# Altium project REGENIX (1).PrjPCB (part 1 of 2)
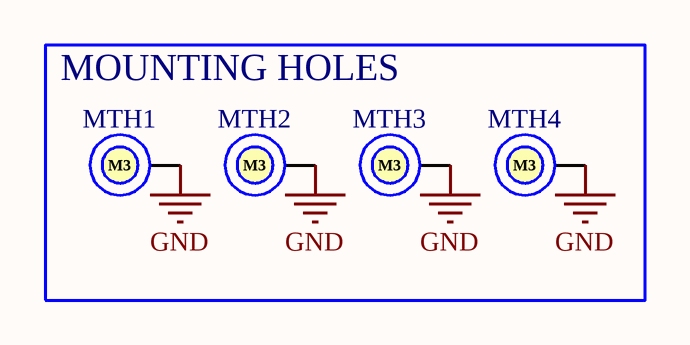
[diagram p0: REGENIX_TITLE.SchDoc]
Project_Date: 2025-02-27; Project_DateCode: DCXXXX; Project_Designer1: Edouard Moffet; Project_Designer2: Marylin Bechara; Project_Designer3: Mathieu Trudelle; Project_Designer4: -; Project_Global: Regenix Biotechnology; Project_Group: Main_PCB; Project_Name: PMC; Project_Revision: 0.00; Project_Stencil_Bot_Thickness: 0.1 MM; Project_Stencil_Top_Thickness: 0.1 MM
15 sheets, 396 parts. Net scope: flat (ports and power ports of the same name join across sheets).
Sheets:
  REGENIX_TITLE.SchDoc
  REGENIX_Battery_Protection.SchDoc
  REGENIX_RS485.SchDoc
  REGENIX_I2C.SchDoc
  REGENIX_Relais_12V.SchDoc
  REGENIX_USB-C.SchDoc
  REGENIX_ESP32.SchDoc
  REGENIX_DRIVER.SchDoc
  REGENIX_Convertisseurs.SchDoc
  REGENIX_DRIVER_2.SchDoc
  REGENIX_DRIVER_3.SchDoc
  REGENIX_Relais_24V_1.SchDoc
  REGENIX_Relais_24V_2.SchDoc
  REGENIX_Relais_24V_3.SchDoc
  REGENIX_Relais_24V_4.SchDoc

## Sheet REGENIX_TITLE.SchDoc
size Tabloid; Date: Date; Author: Author 1; DocumentNumber: 1; Revision: 1; SheetNumber: 1; SheetTotal: 12; Size: 11x17; Sheet_Name: Sheet Description

### Parts
MTH1  M3  [MTH_M3]  (no BOM)
MTH2  M3  [MTH_M3]  (no BOM)
MTH3  M3  [MTH_M3]  (no BOM)
MTH4  M3  [MTH_M3]  (no BOM)

### Blocks framed on the sheet
MOUNTING HOLES: MTH1-MTH4

### Nets
GND: MTH1.1 MTH2.1 MTH3.1 MTH4.1

### Notes on the sheet
- Revision history
- Package size conversion
- Metric
- 1005
- 1608
- Imperial
- 0402
- 0603
- Revision
- 2012
- 3216
- 0805
- 1206
- 3225
- 6432
- 1210
- 2512
- Date :
- Project Title
- Global Project
- Size
- Date
- Group
- Sheet
- of
- Filename
- Designers

### Library data of the parts
MTH1-MTH4 = MTH_M3: MTH - MOUNTING HOLE M3 PLATED - M3; GRAMS Lib Spec: 2.8; Magnetic Material: NO; Cryo: UNKNOWN; Value: *; Tolerance: *; Voltage Rating: *; Current Rating: *; Power Max: *; HelpURL: https://littlemachineshop.com/images/gallery/PDF/TapDrillSizes.pdf; CreatedBy/Date: Jonathan Bouchard 2018-07-23; VerifiedBy: Arnaud Samson 23-07-18; Temperature: *; Package: M3; Manufacturer #1: *; Manufacturer #2: *; Note: *; Assembly Type: NONE; Part Number #2: *; Part Number #1: *; Polarized: *; Supplier 1: *; Supplier Part Number 1: *

## Sheet REGENIX_Battery_Protection.SchDoc
size Tabloid; Date: Date; Author: Author 1; DocumentNumber: 2; Revision: 1; SheetNumber: 2; SheetTotal: 11; Size: 11x17; Sheet_Name: BATTERY PROTECTION & AUXILIARY
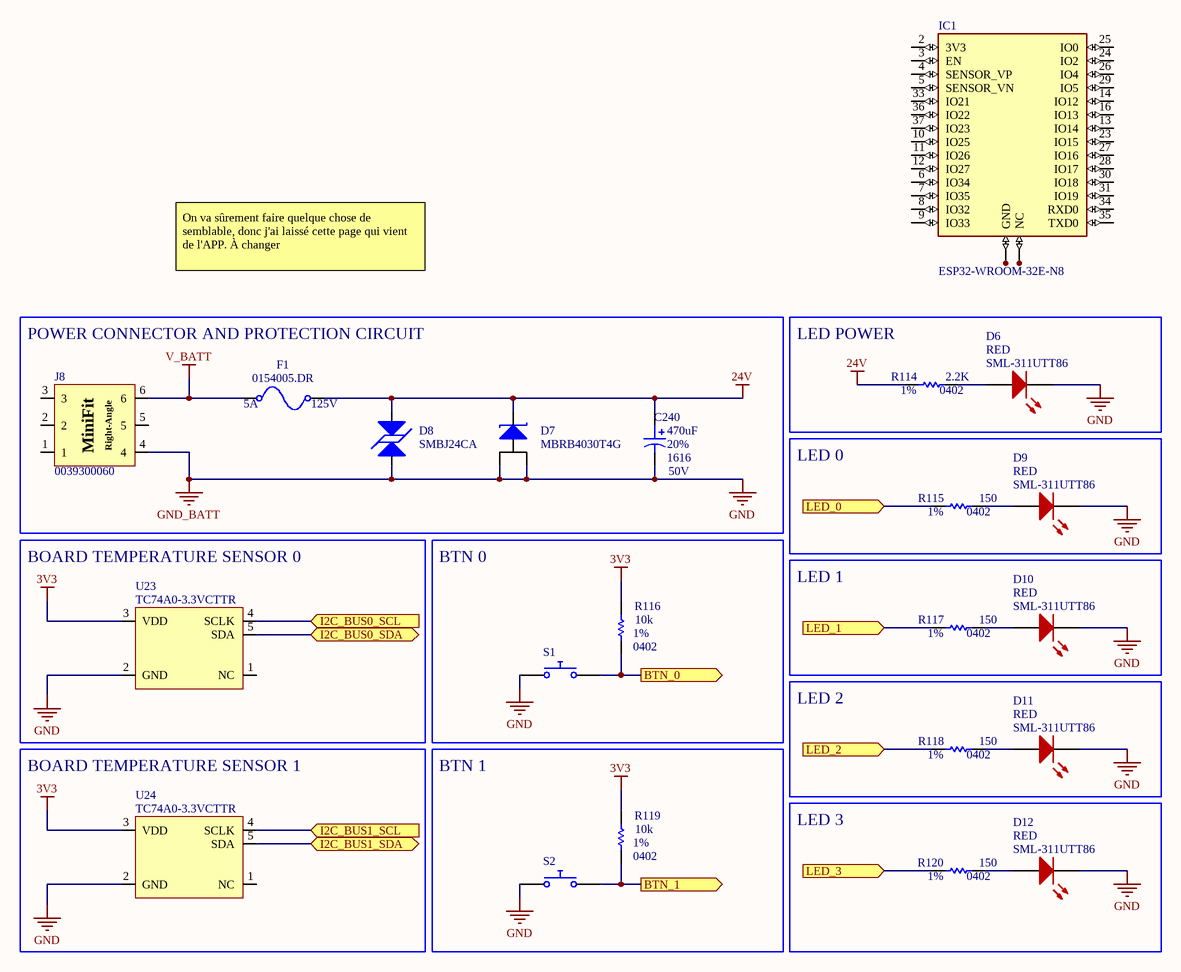
[diagram p1: REGENIX_Battery_Protection.SchDoc]

### Parts
C240  value 470uF  Voltage: 50V  Package: 1616  Precision: 20%  [CAP_ALU_1616_vishay]  (hidden comment: MAL214699108E3)
D6  SML-311UTT86  value RED  [LED_0603]
D7  MBRB4030T4G  [DIO_SCHOTTKY_MBRB4030T4G]
D8  SMBJ24CA  [TVS_PWR_SMBJ36CA]
D9  SML-311UTT86  value RED  [LED_0603]
D10  SML-311UTT86  value RED  [LED_0603]
D11  SML-311UTT86  value RED  [LED_0603]
D12  SML-311UTT86  value RED  [LED_0603]
F1  0154005.DR  Voltage Rating: 125V  Current Rating: 5A  [FUS_0154XXX.DR]
IC1  ESP32-WROOM-32E-N8  [ESP32WROOM32EN8]
J8  0039300060  [CON_MINIFIT_0039300060]
R114  value 2.2K  Package: 0402  Precision: 1%  [RES_0402]  (hidden comment: RES - 0402)
R115  value 150  Package: 0402  Precision: 1%  [RES_0402]  (hidden comment: RES - 0402)
R116  value 10k  Package: 0402  Precision: 1%  [RES_0402]  (hidden comment: RES - 0402)
R117  value 150  Package: 0402  Precision: 1%  [RES_0402]  (hidden comment: RES - 0402)
R118  value 150  Package: 0402  Precision: 1%  [RES_0402]  (hidden comment: RES - 0402)
R119  value 10k  Package: 0402  Precision: 1%  [RES_0402]  (hidden comment: RES - 0402)
R120  value 150  Package: 0402  Precision: 1%  [RES_0402]  (hidden comment: RES - 0402)
S1  Push Button Normally Opened  (value not drawn)
S2  Push Button Normally Opened  (value not drawn)
U23  TC74A0-3.3VCTTR  [SEN_TEMP_TC74A0-3.3VCTTR]
U24  TC74A0-3.3VCTTR  [SEN_TEMP_TC74A0-3.3VCTTR]

### Blocks framed on the sheet
POWER CONNECTOR AND PROTECTION CIRCUIT: C240 D7 D8 F1 J8
LED POWER: D6 R114
LED 0: D9 R115
BOARD TEMPERATURE SENSOR 0: U23
BTN 0: R116 S1
LED 1: D10 R117
LED 2: D11 R118
BOARD TEMPERATURE SENSOR 1: U24
BTN 1: R119 S2
LED 3: D12 R120

### Ports
BTN_0 (out), BTN_1 (out), I2C_BUS0_SCL (in), I2C_BUS0_SDA (bidir), I2C_BUS1_SCL (in), I2C_BUS1_SDA (bidir), LED_0 (in), LED_1 (in), LED_2 (in), LED_3 (in)

### Nets
3V3: R116.2 R119.2 U23.3(VDD) U24.3(VDD)
24V: C240.1 D7.4 D8.1 F1.2 R114.2
GND: C240.2 D6.K D7.1(A) D7.3 D8.2 D9.K D10.K D11.K D12.K J8.4 S1.1 S2.1 U23.2(GND) U24.2(GND)  [also labelled GND_BATT]
V_BATT: F1.1 J8.6
BTN_0: R116.1 S1.2 ; port BTN_0
BTN_1: R119.1 S2.2 ; port BTN_1
I2C_BUS0_SCL: U23.4(SCLK) ; port I2C_BUS0_SCL
I2C_BUS0_SDA: U23.5(SDA) ; port I2C_BUS0_SDA
I2C_BUS1_SCL: U24.4(SCLK) ; port I2C_BUS1_SCL
I2C_BUS1_SDA: U24.5(SDA) ; port I2C_BUS1_SDA
LED_0: R115.2 ; port LED_0
LED_1: R117.2 ; port LED_1
LED_2: R118.2 ; port LED_2
LED_3: R120.2 ; port LED_3
NetD6_A: D6.A R114.1
NetD9_A: D9.A R115.1
NetD10_A: D10.A R117.1
NetD11_A: D11.A R118.1
NetD12_A: D12.A R120.1
NetIC1_1: IC1.1(GND) IC1.15(GND) IC1.38(GND) IC1.39(GND) IC1.40(GND) IC1.41(GND) IC1.42(GND) IC1.43(GND) IC1.44(GND) IC1.45(GND) IC1.46(GND) IC1.47(GND)
NetIC1_17: IC1.17(NC) IC1.18(NC) IC1.19(NC) IC1.20(NC) IC1.21(NC) IC1.22(NC) IC1.32(NC)

Not connected (* = marked no-connect by the designer): IC1 2(3V3) 3(EN) 4(SENSOR_VP) 5(SENSOR_VN) 6(IO34) 7(IO35) 8(IO32) 9(IO33) 10(IO25) 11(IO26) 12(IO27) 13(IO14) 14(IO12) 16(IO13) 23(IO15) 24(IO2) 25(IO0) 26(IO4) 27(IO16) 28(IO17) 29(IO5) 30(IO18) 31(IO19) 33(IO21) 34(RXD0) 35(TXD0) 36(IO22) 37(IO23); J8 1 2 3 5; U23 1(NC); U24 1(NC)

### Notes on the sheet
- On va sûrement faire quelque chose de semblable, donc j'ai laissé cette page qui vient de l'APP. À changer
- Sheet Name
- Project Title
- Global Project
- Revision
- Size
- Date
- Group
- Sheet
- of
- Filename
- Designers
- (in symbol CON_MINIFIT_0039300060) MiniFit; Right-Angle

### Library data of the parts
C240 = CAP_ALU_MAL214699108E3: CAP - ALU 470uF 20% 50V - 1616; Current: 1.3A; Mfg: Vishay Dale; Mfg Part Number: MAL214699108E3; HelpURL: http://www.vishay.com/docs/28403/146cti.pdf; CreatedBy: Jonathan Bouchard; Temperature: -55°C to 125°C; Power: *; Supplier 1: Digikey; Supplier Part Number 1: 4442PHCT-ND
D6 D9-D12 = LED_SML-311UTT86: LED - 620nM RED 2mA - 0603; Voltage: 1.8V; Mfg: ROHM Semiconductor; Power: 44mW; Current: 2mA; HelpURL: http://media.digikey.com/pdf/Data%20Sheets/Rohm%20PDFs/SML-311%20Series.pdf; CreatedBy: Jonathan Bouchard; Temperature: -30°C to 85°C; Package: 0603; Precision: *; Mfg Part Number: SML-311UTT86; Supplier 1: Digikey; Supplier Part Number 1: 511-1304-1-ND
D7 = DIO_SCHOTTKY_MBRB4030T4G: DIO - 30V MAX 40 A - TO-263-3; Manufacturer #1: ON Semiconductor; Value: Vf = 550mV @ 40A; Current Rating: 40A; GRAMS Lib Spec: 2.8; Magnetic Material: NO; Polarized: Yes; Cryo: UNKNOWN; Tolerance: *; Voltage Rating: 30V; Power Max: *; HelpURL: http://www.onsemi.com/pub/Collateral/MBRB4030-D.PDF; CreatedBy/Date: Arnaud Samson - 06/07/18; VerifiedBy: Jonathan Bouchard 2018-07-12; Temperature: -65°C ~ 175°C; Package: D2PAK; Manufacturer #2: *; Note: *; Assembly Type: SMD; Part Number #2: *; Part Number #1: MBRB4030T4G; Supplier 1: Digi-Key; Supplier Part Number 1: MBRB4030T4GOSCT-ND
D8 = TVS_PWR_SMBJ24CA: TVS - 24V 26.7V 600W - DO214AA; Manufacturer #1: Littelfuse Inc.; Value: Vbr = 26.7V -  Clamp = 38.9V; Voltage Rating: 24V Standoff; Current Rating: 15.5A; GRAMS Lib Spec: 2.8; Magnetic Material: UNKNOWN; Polarized: NO; Tolerance: *; Power Max: 600W; HelpURL: http://www.littelfuse.com/~/media/electronics/datasheets/tvs_diodes/littelfuse_tvs_diode_smbj_datasheet.pdf.pdf; CreatedBy/Date: Arnaud Samson - 06/07/18; VerifiedBy: Jonathan Bouchard - 2018-07-13; Temperature: -65°C ~ 150°C (TJ); Package: DO214AA; Manufacturer #2: *; Note: *; Assembly Type: SMD; Part Number #2: *; Part Number #1: SMBJ24CA; Supplier 1: Digi-Key; Supplier Part Number 1: SMBJ24CALFCT-ND; Cryo: UNKNOWN
F1 = FUS_0154005.DR: FUS - 5 A 125 VAC/VDC - 2-SMD; Manufacturer #1: Littelfuse Inc.; Value: 5A 125V AC/DC FAST; GRAMS Lib Spec: 2.8; Magnetic Material: UNKNOWN; Polarized: NO; Tolerance: *; Power Max: *; HelpURL: http://www.littelfuse.com/~/media/electronics/datasheets/fuses/littelfuse_fuse_154_154t_154l_154tl_datasheet.pdf.pdf; CreatedBy/Date: Arnaud Samson - 06/07/18; VerifiedBy: Jonathan Bouchard 2018-07-16; Temperature: -55°C ~ 125°C; Package: 2-SMD; Manufacturer #2: *; Note: *; Assembly Type: SMD; Part Number #2: *; Part Number #1: 0154005.DR; Supplier 1: Digi-Key; Supplier Part Number 1: F1228CT-ND; Cryo: UNKNOWN
IC1 = ESP32-WROOM-32E-N8: Bluetooth, WiFi 802.11b/g/n, Bluetooth v4.2 +EDR, Class 1, 2 and 3 Transceiver Module 2.4GHz ~ 2.5GHz PCB Trace Surface Mount; MF: Espressif Systems; SnapEDA_Link: https://www.snapeda.com/parts/ESP32-WROOM-32E-N8/Espressif+Systems/view-part/?ref=snap; Package: SMD-44 Espressif Systems; Value: *; MP: ESP32-WROOM-32E-N8; Check_prices: https://www.snapeda.com/parts/ESP32-WROOM-32E-N8/Espressif+Systems/view-part/?ref=eda
J8 = CON_MINIFIT_0039300060: CON - Mini-Fit Through Hole, Right Angle 6 position; Manufacturer #1: Molex; Current Rating: 8A; GRAMS Lib Spec: 2.8; Magnetic Material: Unknown; Polarized: Yes; Voltage Rating: 600V; Assembly Type: TH; CreatedBy/Date: Joel Lemay 2018-06-21; HelpURL: https://www.molex.com/pdm_docs/sd/039300060_sd.pdf; Manufacturer #2: *; Package: TH; Part Number #1: 0039300060; Part Number #2: *; Power Max: *; Supplier 1: Digi-Key; Supplier Part Number 1: WM21353-ND; Temperature: - 40°C to + 80°C; Tolerance: *; Value: *; VerifiedBy: Caroline Paulin - 10 sept 2018; Cryo: UNKNOWN
R114-R120 = RES - 0402: Voltage: 50V; Power: 1/16W; Current: *; CreatedBy: Jonathan Bouchard
S1 S2 = Push Button NO: closed: 0; Rclosed: 1m; Ropen: 1Meg; SimulationGenericComponent: True
U23 U24 = SENS_TEMP_TC74A0-3.3VCTTR: SENS - TEMPERATURE SENSOR I2C/SMBUS - SOT23-5; Voltage: 2.7 V ~ 5.5 V; Mfg: Microchip; Precision: ±2°C (±3°C); Current: *; Power: *; Mfg Part Number: TC74A0-3.3VCTTR; HelpURL: http://ww1.microchip.com/downloads/en/DeviceDoc/21462D.pdf; CreatedBy: Jonathan Bouchard; Temperature: -40°C ~ 125°C; Value: *; Package: SOT23-5; Supplier 1: Digikey; Supplier Part Number 1: TC74A0-3.3VCTDKR-ND

## Sheet REGENIX_RS485.SchDoc
size Tabloid; Date: Date; Author: Author 1; DocumentNumber: 3; Revision: 1; SheetNumber: 4; SheetTotal: 17; Size: 11x17; Sheet_Name: RS485
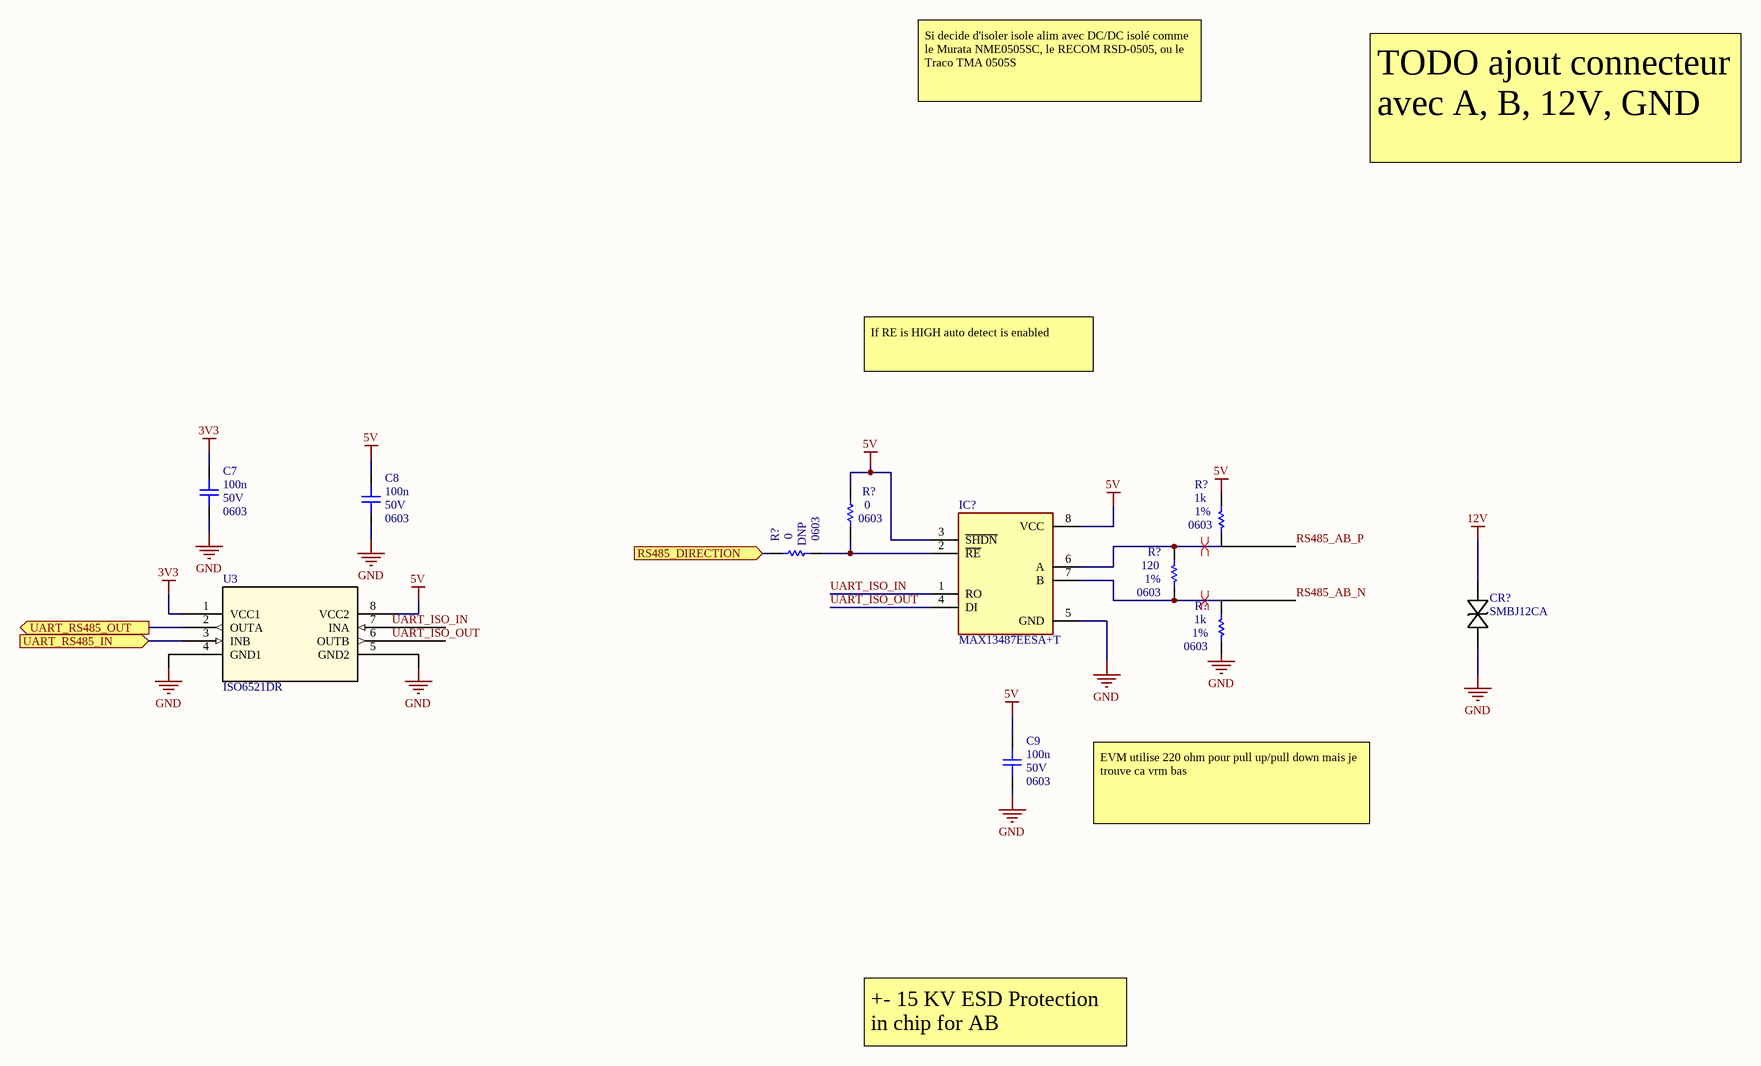
[diagram p2: REGENIX_RS485.SchDoc]

### Parts
(Parts that share a designator on the sheet are numbered #1, #2 ... from top to bottom, then left to right.)
C7  value 100n  Voltage: 50V  Package: 0603  [CAP_0603]  (hidden comment: CAP - 0603)
C8  value 100n  Voltage: 50V  Package: 0603  [CAP_0603]  (hidden comment: CAP - 0603)
C9  value 100n  Voltage: 50V  Package: 0603  [CAP_0603]  (hidden comment: CAP - 0603)
CR?  SMBJ12CA  [SMBJSeries_LTF]
IC?  MAX13487EESA+T  [SOIC127P600X175-8N]
R?#1  value 0  Package: 0603  [RES_0603]  (hidden comment: RES - 0603)
R?#2  value 1k  Package: 0603  Precision: 1%  [RES_0603]  (hidden comment: RES - 0603)
R?#3  value 0  NI: DNP  Package: 0603  [RES_0603]  (hidden comment: RES - 0603)
R?#4  value 120  Package: 0603  Precision: 1%  [RES_0603]  (hidden comment: RES - 0603)
R?#5  value 1k  Package: 0603  Precision: 1%  [RES_0603]  (hidden comment: RES - 0603)
U3  ISO6521DR  [SOIC8_D_TEX]

### Ports
RS485_DIRECTION (in), UART_RS485_IN (in), UART_RS485_OUT (out)

### Nets
3V3: C7.2 U3.1(VCC1)
5V: C8.2 C9.2 IC?.3(~{SHDN}) IC?.8(VCC) R?#1.2 R?#2.2 U3.8(VCC2)
12V: CR?.1
GND: C7.1 C8.1 C9.1 CR?.2 IC?.5(GND)
RS485_DIRECTION: R?#3.2 ; port RS485_DIRECTION
UART_ISO_IN: IC?.1(RO)
UART_ISO_OUT: IC?.4(DI)
UART_RS485_IN: U3.3(INB) ; port UART_RS485_IN
UART_RS485_OUT: U3.2(OUTA) ; port UART_RS485_OUT
NetIC?_2: IC?.2(~{RE}) R?#1.1 R?#3.1
NetIC?_6: IC?.6(A) R?#2.1 R?#4.2
NetIC?_7: IC?.7(B) R?#4.1 R?#5.2

Not connected (* = marked no-connect by the designer): R?#5 1; U3 4(GND1) 5(GND2) 6(OUTB) 7(INA)

### Layout directives
differential pair: NetIC?_6, NetIC?_7

### Notes on the sheet
- Si decide d'isoler isole alim avec DC/DC isolé comme le Murata NME0505SC, le RECOM RSD-0505, ou le Traco TMA 0505S
- TODO ajout connecteur avec A, B, 12V, GND
- If RE is HIGH auto detect is enabled
- EVM utilise 220 ohm pour pull up/pull down mais je trouve ca vrm bas
- +- 15 KV ESD Protection in chip for AB
- Labels drawn without touching a wire or pin: GND, RS485_AB_N, RS485_AB_P, UART_ISO_IN, UART_ISO_OUT
- Sheet Name
- Project Title
- Global Project
- Revision
- Size
- Date
- Group
- Sheet
- of
- Filename
- Designers

### Library data of the parts
C7-C9 = CAP - 0603: Precision: 10%; Current: *; CreatedBy: Jonathan Bouchard; Power: *
CR? = SMBJ12CA: No Description Available; Mfr_Name: Littelfuse Inc
IC? = MAX13487EESA+T: Integrated Circuit; Manufacturer_Name: Analog Devices; Datasheet Link: https://datasheets.maximintegrated.com/en/ds/MAX13487E-MAX13488E.pdf; Height: 1.75mm; Manufacturer_Part_Number: MAX13487EESA+T; Mouser Part Number: 700-MAX13487EESAT; Mouser Price/Stock: https://www.mouser.co.uk/ProductDetail/Analog-Devices-Maxim-Integrated/MAX13487EESA%2bT?qs=CDqwynd4ZNqR%252BznpqLLGdQ%3D%3D; Arrow Part Number: MAX13487EESA+T; Arrow Price/Stock: https://www.arrow.com/en/products/max13487eesat/analog-devices?utm_currency=USD&region=nac
R?#1 R?#3 = RES - 0603: Precision: 1%; Current: *; CreatedBy: Jonathan Bouchard
U3 = ISO6521DR: No Description Available; Mfr_Name: Texas Instruments; RefDes: RefDes; Type: Type
R?#2 R?#4 R?#5 = RES - 0603: Current: *; CreatedBy: Jonathan Bouchard

## Sheet REGENIX_I2C.SchDoc
size Tabloid; SheetNumber: 5; SheetTotal: 17; Sheet_Name: Insert name in Document Parameters; Size: 11x17
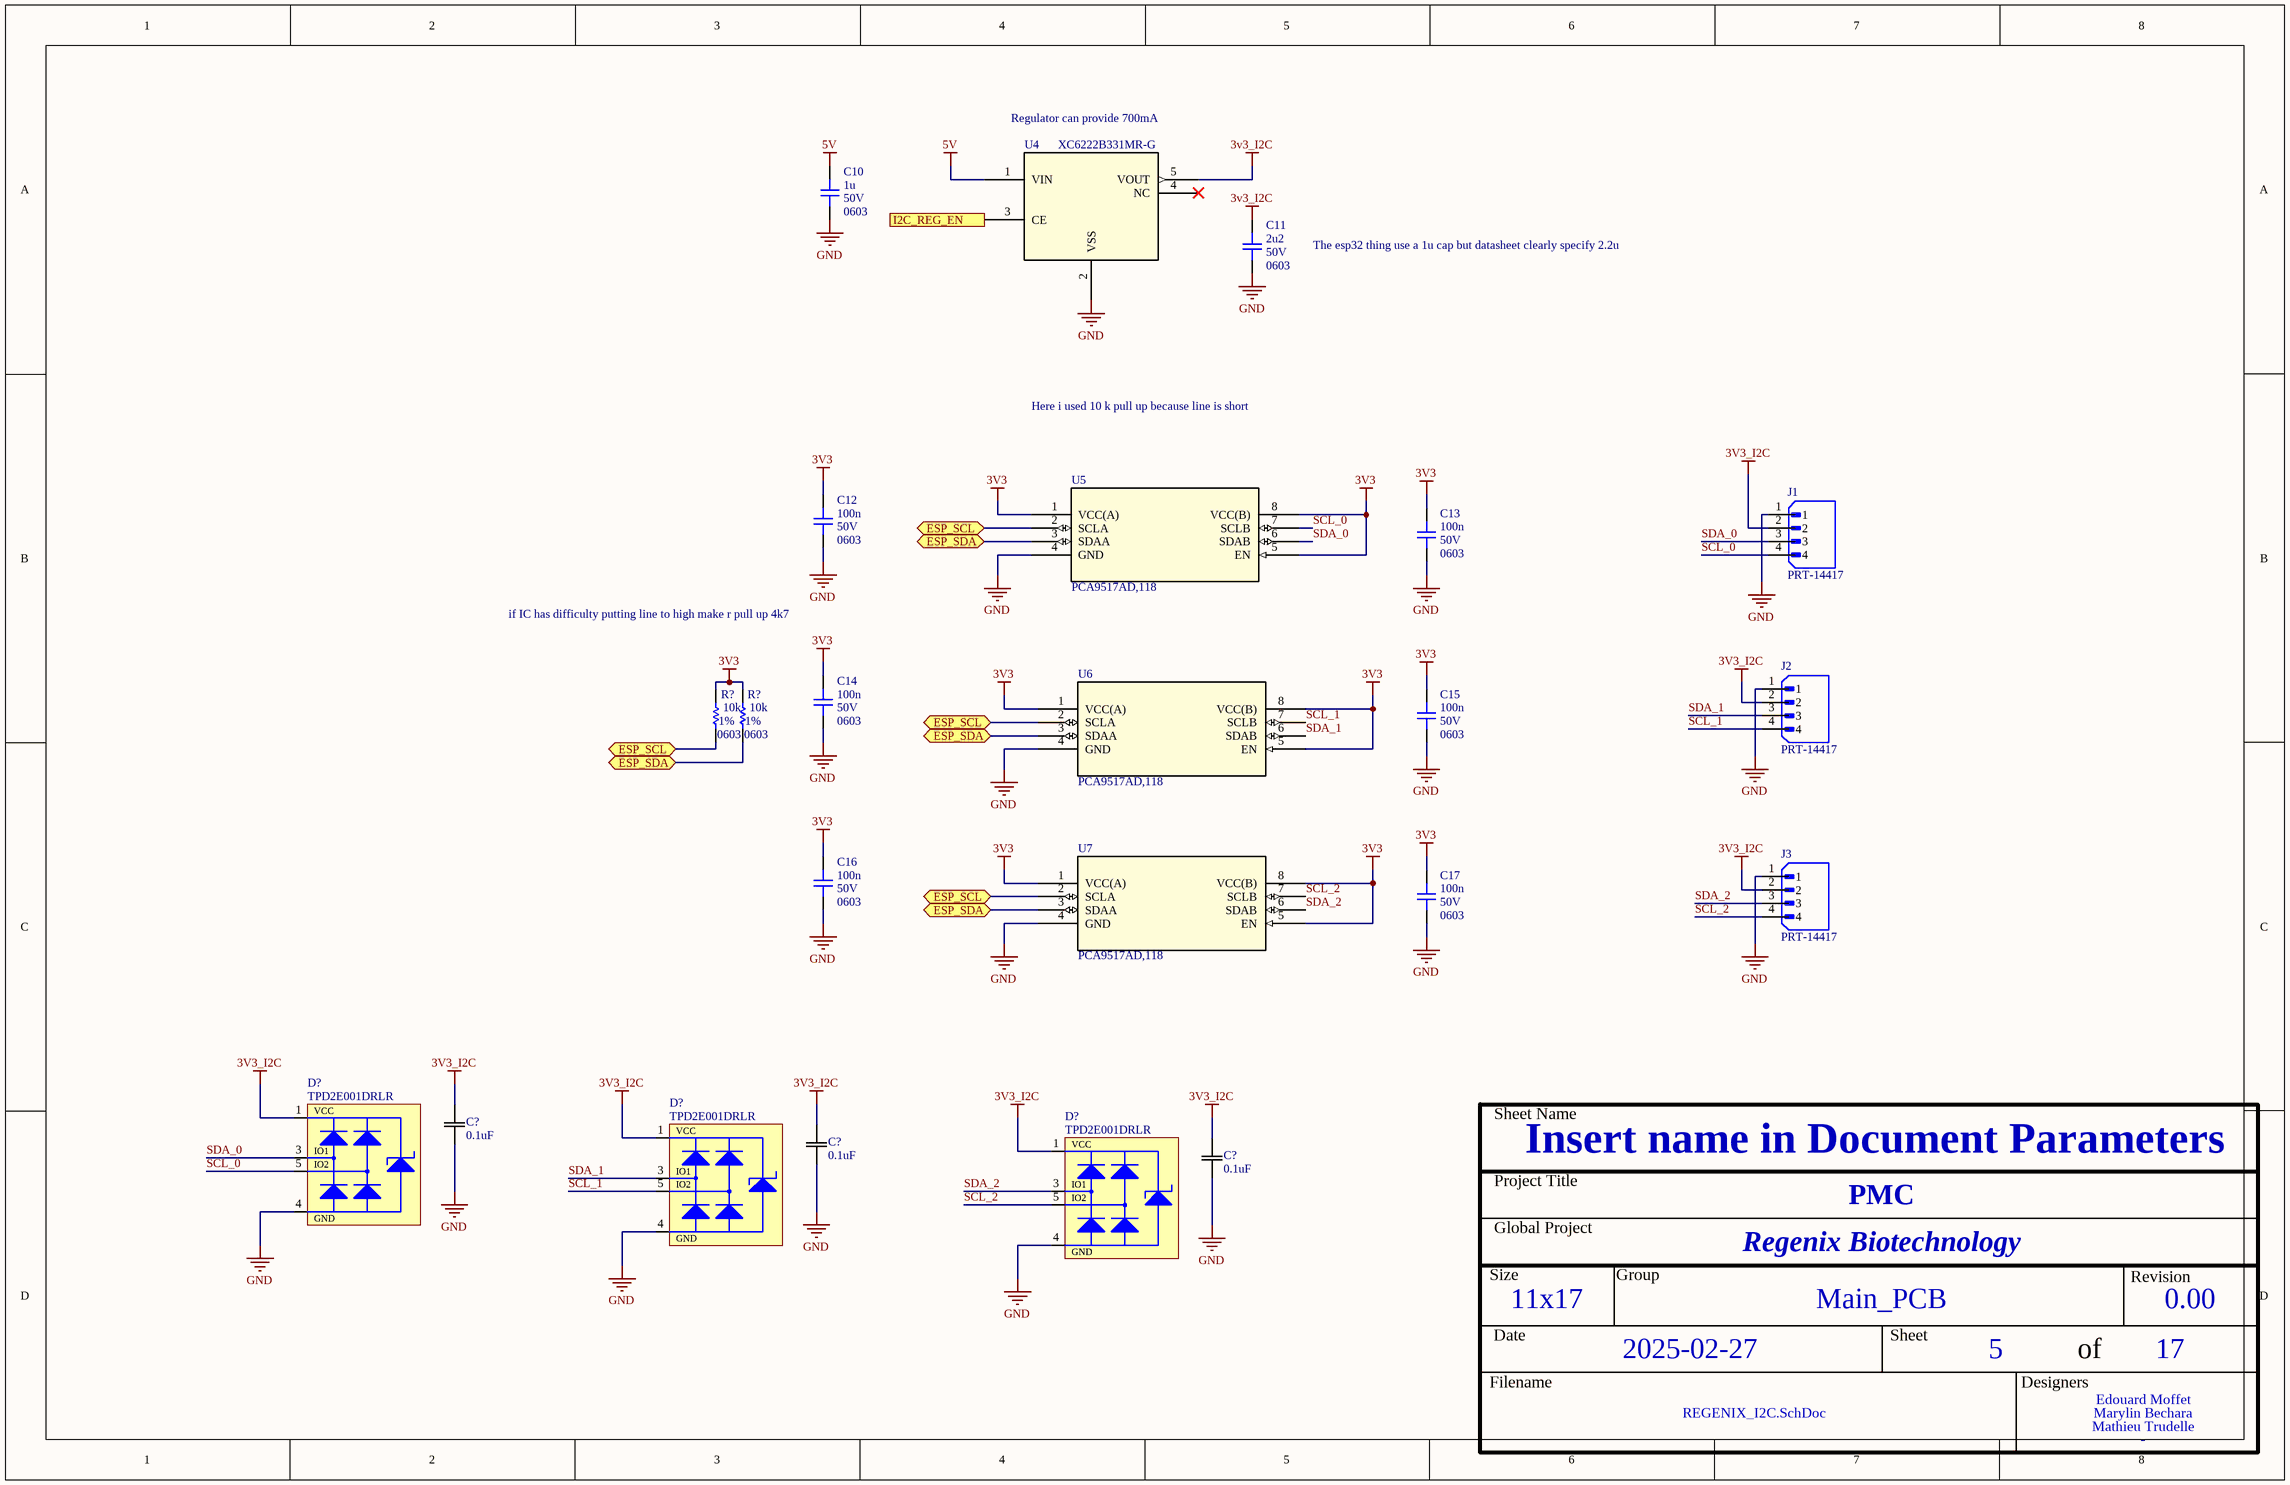
[diagram p3: REGENIX_I2C.SchDoc]

### Parts
(Parts that share a designator on the sheet are numbered #1, #2 ... from top to bottom, then left to right.)
C10  value 1u  Voltage: 50V  Package: 0603  [CAP_0603]  (hidden comment: CAP - 0603)
C11  value 2u2  Voltage: 50V  Package: 0603  [CAP_0603]  (hidden comment: CAP - 0603)
C12  value 100n  Voltage: 50V  Package: 0603  [CAP_0603]  (hidden comment: CAP - 0603)
C13  value 100n  Voltage: 50V  Package: 0603  [CAP_0603]  (hidden comment: CAP - 0603)
C14  value 100n  Voltage: 50V  Package: 0603  [CAP_0603]  (hidden comment: CAP - 0603)
C15  value 100n  Voltage: 50V  Package: 0603  [CAP_0603]  (hidden comment: CAP - 0603)
C16  value 100n  Voltage: 50V  Package: 0603  [CAP_0603]  (hidden comment: CAP - 0603)
C17  value 100n  Voltage: 50V  Package: 0603  [CAP_0603]  (hidden comment: CAP - 0603)
C?#1  0.1uF  [CAP_CL10_SAM]
C?#2  0.1uF  [CAP_CL10_SAM]
C?#3  0.1uF  [CAP_CL10_SAM]
D?#1  TPD2E001DRLR  [TVS_USB_TPD2E001DRLR]
D?#2  TPD2E001DRLR  [TVS_USB_TPD2E001DRLR]
D?#3  TPD2E001DRLR  [TVS_USB_TPD2E001DRLR]
J1  PRT-14417  [SPARKFUN_PRT-14417]
J2  PRT-14417  [SPARKFUN_PRT-14417]
J3  PRT-14417  [SPARKFUN_PRT-14417]
R?#6  value 10k  Package: 0603  Precision: 1%  [RES_0603]  (hidden comment: RES - 0603)
R?#7  value 10k  Package: 0603  Precision: 1%  [RES_0603]  (hidden comment: RES - 0603)
U4  XC6222B331MR-G  [SOT-25_TOR]
U5  PCA9517AD,118  [SO8_SOT96-1_NXP]
U6  PCA9517AD,118  [SO8_SOT96-1_NXP]
U7  PCA9517AD,118  [SO8_SOT96-1_NXP]

### Ports
ESP_SCL (bidir), ESP_SDA (bidir), I2C_REG_EN

### Nets
3V3: C12.2 C13.2 C14.2 C15.2 C16.2 C17.2 R?#6.2 R?#7.2 U5.1(VCC(A)) U5.5(EN) U5.8(VCC(B)) U6.1(VCC(A)) U6.5(EN) U6.8(VCC(B)) U7.1(VCC(A)) U7.5(EN) U7.8(VCC(B))
3V3_I2C: C11.2 C?#1.2 C?#2.2 C?#3.2 D?#1.1(VCC) D?#2.1(VCC) D?#3.1(VCC) J1.2 J2.2 J3.2 U4.5(VOUT)
5V: C10.2 U4.1(VIN)
GND: C10.1 C11.1 C12.1 C13.1 C14.1 C15.1 C16.1 C17.1 C?#1.1 C?#2.1 C?#3.1 D?#1.4(GND) D?#2.4(GND) D?#3.4(GND) J1.1 J2.1 J3.1 U4.2(VSS) U5.4(GND) U6.4(GND) U7.4(GND)
ESP_SCL: R?#6.1 U5.2(SCLA) U6.2(SCLA) U7.2(SCLA) ; port ESP_SCL
ESP_SDA: R?#7.1 U5.3(SDAA) U6.3(SDAA) U7.3(SDAA) ; port ESP_SDA
I2C_REG_EN: U4.3(CE) ; port I2C_REG_EN
SCL_0: D?#1.5(IO2) J1.4 U5.7(SCLB)
SCL_1: D?#2.5(IO2) J2.4 U6.7(SCLB)
SCL_2: D?#3.5(IO2) J3.4 U7.7(SCLB)
SDA_0: D?#1.3(IO1) J1.3 U5.6(SDAB)
SDA_1: D?#2.3(IO1) J2.3 U6.6(SDAB)
SDA_2: D?#3.3(IO1) J3.3 U7.6(SDAB)

Not connected (* = marked no-connect by the designer): D?#1 2(NC); D?#2 2(NC); D?#3 2(NC); U4 4(NC)*

### Notes on the sheet
- Regulator can provide 700mA
- The esp32 thing use a 1u cap but datasheet clearly specify 2.2u
- Here i used 10 k pull up because line is short
- if IC has difficulty putting line to high make r pull up 4k7
- Sheet Name
- Project Title
- Global Project
- Size
- Group
- Revision
- Date
- Sheet
- of
- Filename
- Designers

### Library data of the parts
C10-C17 = CAP - 0603: Precision: 10%; Current: *; CreatedBy: Jonathan Bouchard; Power: *
C?#1-C?#3 = CL10B104KB8NNWC: CAP CER 0.1UF 50V X7R 0603 CL10B104KB8NNWC; Mfr_Name: Samsung
D?#1-D?#3 = TVS_USB_TPD2E001DRLR: TVS - USB TVS DIODE 5.5V - SOT-553; Manufacturer #1: Texas Instruments; Value: 11V Breakdown; Voltage Rating: 5.5V (Max); GRAMS Lib Spec: 2.8; Magnetic Material: YES; Cryo: UNKNOWN; Tolerance: *; Current Rating: *; Power Max: *; HelpURL: http://www.ti.com/lit/ds/symlink/tpd2e001.pdf; CreatedBy/Date: Jonathan Bouchard 2018-07-10; VerifiedBy: Arnaud Samson 16-07-18; Temperature: -40°C ~ 85°C (TA); Package: SOT-553; Manufacturer #2: *; Note: *; Assembly Type: SMD; Part Number #2: *; Part Number #1: TPD2E001DRLR; Polarized: YES; Supplier 1: Digi-Key; Supplier Part Number 1: 296-21883-1-ND
J1-J3 = PRT-14417: QWIIC JST CONNECTOR - SMD 4-PIN; MF: SparkFun Electronics; SnapEDA_Link: https://www.snapeda.com/parts/PRT-14417/SparkFun+Electronics/view-part/?ref=snap; Package: None; Value: *; MP: PRT-14417; Check_prices: https://www.snapeda.com/parts/PRT-14417/SparkFun+Electronics/view-part/?ref=eda
U4 = XC6222B331MR-G: No Description Available; Mfr_Name: Torex Semiconductor; RefDes: RefDes; Type: Type
U5-U7 = PCA9517AD,118: No Description Available; Mfr_Name: NXP; RefDes: RefDes; Type: Type
R?#6 R?#7 = RES - 0603: Current: *; CreatedBy: Jonathan Bouchard

## Sheet REGENIX_Relais_12V.SchDoc
size Tabloid; Date: Date; Author: Author 1; DocumentNumber: 2; Revision: 1; SheetNumber: 6; SheetTotal: 17; Size: 11x17; Sheet_Name: BATTERY PROTECTION & AUXILIARY
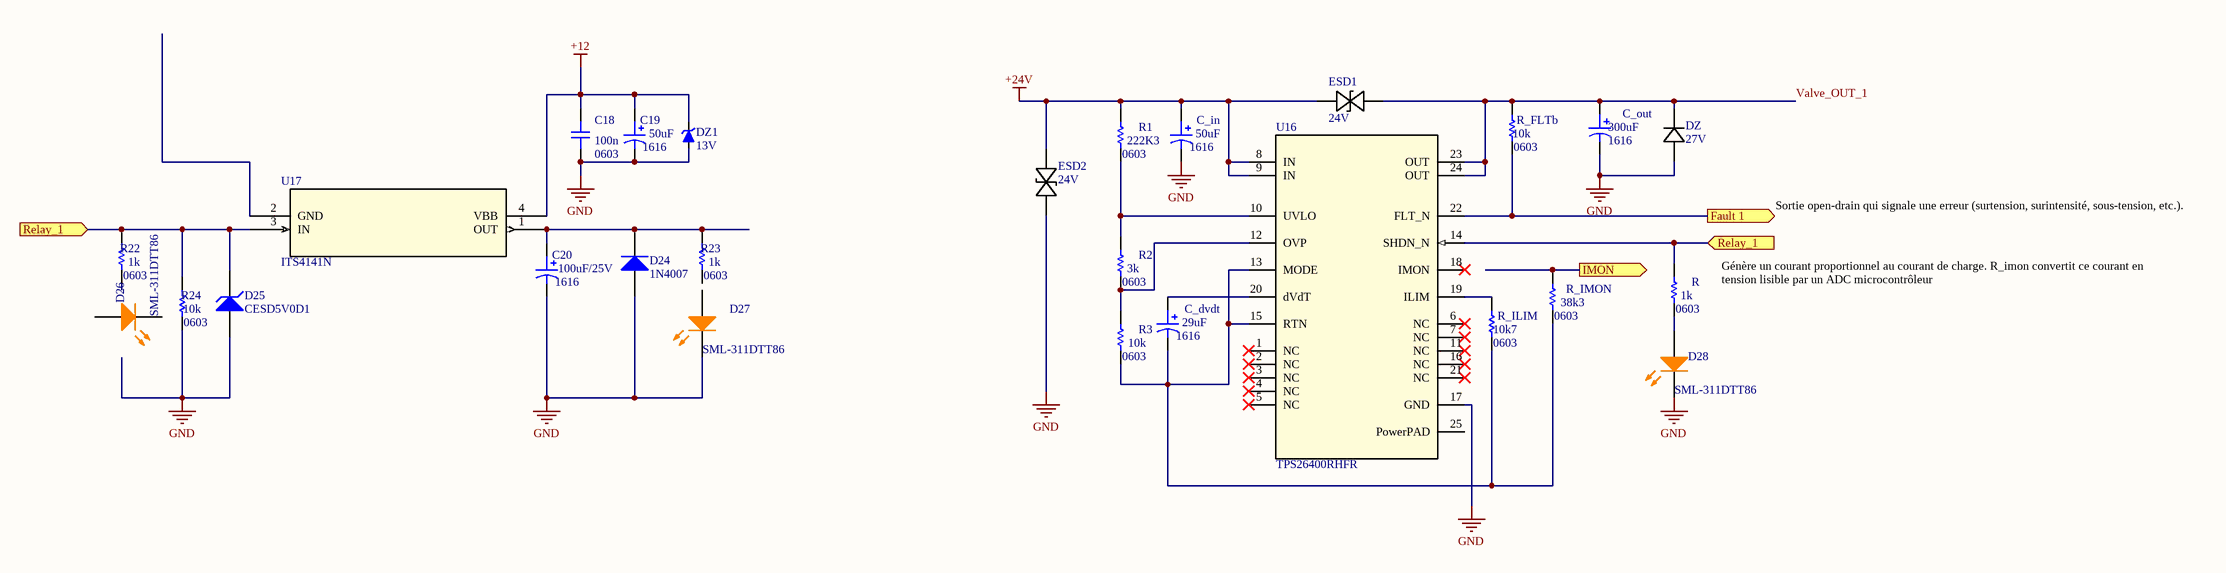
[diagram p4: REGENIX_Relais_12V.SchDoc]

### Parts
(Parts that share a designator on the sheet are numbered #1, #2 ... from top to bottom, then left to right.)
C18  Voltage: 100n  Package: 0603  [CAP_0603]  (hidden comment: CAP - 0603)
C19  value 50uF  Package: 1616  [CAP_ALU_1616_vishay]  (hidden comment: MAL214699108E3)
C20  Package: 1616  [CAP_ALU_1616_vishay]  (hidden comment: MAL214699108E3)
C_dvdt#1  value 29uF  Package: 1616  [CAP_ALU_1616_vishay]  (hidden comment: MAL214699108E3)
C_in#1  value 50uF  Package: 1616  [CAP_ALU_1616_vishay]  (hidden comment: MAL214699108E3)
C_out#1  value 300uF  Package: 1616  [CAP_ALU_1616_vishay]  (hidden comment: MAL214699108E3)
D24  1N4007  [FAIR-DO-41-2]
D25  CESD5V0D1  [JSCJ-SOD-123-2_V]
D26  SML-311DTT86  [LED_0603]
D27  SML-311DTT86  [LED_0603]
D28#1  SML-311DTT86  [LED_0603]
DZ1  Volt: 13V  [SOD-123]  (hidden comment: BZT52C13-TP)
DZ#1  27V  [SOD123_DIO]
ESD1  24V  [TVS_DFN1006-2_MCC]
ESD2  24V  [TVS_DFN1006-2_MCC]
R  Package: 0603  Precision: 1k  [RES_0603]  (hidden comment: RES - 0603)
R1  Package: 0603  Precision: 222K3  [RES_0603]  (hidden comment: RES - 0603)
R2  Package: 0603  Precision: 3k  [RES_0603]  (hidden comment: RES - 0603)
R3  Package: 0603  Precision: 10k  [RES_0603]  (hidden comment: RES - 0603)
R22  Package: 0603  Precision: 1k  [RES_0603]  (hidden comment: RES - 0603)
R23  Package: 0603  Precision: 1k  [RES_0603]  (hidden comment: RES - 0603)
R24  Package: 0603  Precision: 10k  [RES_0603]  (hidden comment: RES - 0603)
R_FLTb  Package: 0603  Precision: 10k  [RES_0603]  (hidden comment: RES - 0603)
R_ILIM  Package: 0603  1%: 10k7  [RES_0603]  (hidden comment: RES - 0603)
R_IMON  Package: 0603  Precision: 38k3  [RES_0603]  (hidden comment: RES - 0603)
U16#1  TPS26400RHFR  [RHF0024A-IPC_A]
U17  ITS4141N  [PG-SOT223_INF]

### Ports
Fault 1 (out), IMON (out), Relay_1 (in)

### Nets
+12: C18.2 C19.1 DZ1.2(K) U17.4(VBB)
+24V: C_in#1.1 ESD1.1(ANODECATHODE) ESD2.1(ANODECATHODE) R1.2 U16#1.8(IN) U16#1.9(IN)
GND: C18.1 C19.2 C20.2 C_in#1.2 C_out#1.2 D24.2(A) D25.1(A) D27.K D28#1.K DZ1.1(A) DZ#1.2 ESD2.2(ANODECATHODE_2) R24.1 U16#1.17(GND)
Fault 1: R_FLTb.1 U16#1.22(FLT_N) ; port Fault 1
IMON: R_IMON.2 ; port IMON
Relay_1: D25.2(K) R.2 R22.2 R24.2 U16#1.14(SHDN_N) U17.3(IN) ; port Relay_1
Valve_OUT_1: C_out#1.1 DZ#1.1 ESD1.2(ANODECATHODE_2) R_FLTb.2 U16#1.23(OUT) U16#1.24(OUT)
NetC20_1: C20.1 D24.1(K) R23.2 U17.1(OUT)
NetC_dvdt#1_1: C_dvdt#1.1 U16#1.20(dVdT)
NetC_dvdt#1_2: C_dvdt#1.2 R3.1 R_ILIM.1 R_IMON.1 U16#1.13(MODE) U16#1.15(RTN)
NetD28#1_A: D28#1.A R.1
NetR1_1: R1.1 R2.2 U16#1.10(UVLO)
NetR2_1: R2.1 R3.2 U16#1.12(OVP)
NetR_ILIM_2: R_ILIM.2 U16#1.19(ILIM)

Not connected (* = marked no-connect by the designer): D26 A K; D27 A; R22 1; R23 1; U16#1 1(NC)* 2(NC)* 3(NC)* 4(NC)* 5(NC)* 6(NC)* 7(NC)* 11(NC)* 16(NC)* 18(IMON)* 21(NC)* 25(PowerPAD); U17 2(GND)

### Notes on the sheet
- Sortie open-drain qui signale une erreur (surtension, surintensité, sous-tension, etc.).
  Devient LOW (0V) en cas de défaut.
- (near R) Génère un courant proportionnel au courant de charge. R_imon convertit ce courant en tension lisible par un ADC microcontrôleur
- Sheet Name
- Project Title
- Global Project
- Revision
- Size
- Date
- Group
- Sheet
- of
- Filename
- Designers
- (in symbol CAP_ALU_MAL214699108E3) 100uF/25V

### Library data of the parts
C18 = CAP - 0603: Precision: 10%; Current: *; CreatedBy: Jonathan Bouchard; Power: *
C19 C20 C_dvdt#1 C_in#1 C_out#1 = CAP_ALU_MAL214699108E3: as C240 on sheet REGENIX_Battery_Protection; Mfg Part Number: MAL214699108E3; HelpURL: http://www.vishay.com/docs/28403/146cti.pdf; CreatedBy: Jonathan Bouchard; Temperature: -55°C to 125°C; Power: *; Supplier 1: Digikey; Supplier Part Number 1: 4442PHCT-ND
D24 = CMP-004-00007-2: General Purpose Rectifier, 1.1 V, 1.0 A, -55 to 175 degC, 2-Pin DO-41, RoHS, Tape and Reel; Manufacturer: Fairchild; Peak Reverse Current: 5uA; Max Surge Current: 30A; Elements: 1; Forward Voltage: 1.1V; Package Version: Rev. 2, 09/2008; Forward Current: 1A; Package Quantity: 5000; Packaging: TapeandReel; Package URL: http://www.fairchildsemi.com/dwg/DO/DO41A.pdf; Manufacturer URL: https://www.fairchildsemi.com/; Package Reference: DO-41-2; Pins: 2; Min Operating Temperature: -55°C; Datasheet Version: Rev. 1.1.0, 11/2014; Max Operating Temperature: 175°C; RoHS Compliant: True; Case/Package: DO-41-2; Mounting Technology: TH; Package Description: 2-Pin Axial Lead, Dia 2.375 mm, Body Length 4.63 mm; Datasheet URL: https://www.fairchildsemi.com/datasheets/1N/1N4007.pdf
D25 = CMP-004-00020-2: Uni-driection ESD Protection Diode, 5 V, 1 uA, 2-Pin SOD-123, RoHS, Tape and Reel; Manufacturer: Jiangsu Changjiang Electronics Technology; Datasheet URL: http://www.cj-elec.com/gallery/txUpfile/f05a5831e2d7f622a930855050fbe076.pdf; Datasheet Version: Rev. B, 04/2014; Package Description: 2-Pin Surface Mount Device, Body 2.7 x 1.6 mm; Package Reference: SOD-123-2; RoHS Compliant: Unknown; Package URL: http://www.cj-elec.com/txUpfile/201412112231195145.pdf; Case/Package: SOD-123-2; Mounting Technology: SM
D26 D27 D28#1 = LED_SML-311DTT86: LED - 611nM ORANGE 2mA - 0603; Voltage: 1.8V; Mfg: ROHM Semiconductor; Power: 44mW; Current: 2mA; HelpURL: http://media.digikey.com/pdf/Data%20Sheets/Rohm%20PDFs/SML-311%20Series.pdf; CreatedBy: Jonathan Bouchard; Temperature: -40°C to 85°C; Package: 0603; Precision: *; Mfg Part Number: SML-311DTT86; Supplier 1: Digikey; Supplier Part Number 1: 511-1303-1-ND
DZ1 = BZT52C13-TP: Zener Diode 13 V 200 mW ±6% Surface Mount SOD-123; Watt: 200mW; Grade: None; Package / Case: SOD-123; Supplier 1: Digi-Key; Supplier Part Number 1: BZT52C13-TPMSCT-ND; Mounted: Yes; Precision: 6%
DZ#1 = MMSZ5254B-7-F: DIODE ZENER 27V 500MW SOD123 MMSZ5254B-7-F; Mfr_Name: Diodes Inc
ESD1 ESD2 = ESDSBLC24VLB-TP: TVS DIODE 24VWM 36VC 2-DFN1006 ESDSBLC24VLB-TP; Mfr_Name: MCC
U16#1 = TPS26400RHFR: No Description Available; Mfr_Name: Texas Instruments; TYPE: TYPE; RefDes: RefDes
U17 = ITS4141N: No Description Available; Mfr_Name: Infineon; Digi-Key_Part_Number_4: ITS4141NHUMA1TR-ND; Digi-Key_Part_Number_3: ITS4141NTR-ND; Digi-Key_Part_Number_1: ITS4141NCT-ND; Digi-Key_Part_Number_2: ITS4141NDKR-ND; RefDes: RefDes; Type: Type
R R1-R3 R22-R24 R_FLTb R_ILIM R_IMON = RES - 0603: Current: *; CreatedBy: Jonathan Bouchard

## Sheet REGENIX_USB-C.SchDoc
size Tabloid; Date: Date; Author: Author 1; DocumentNumber: 3; Revision: 1; SheetNumber: 7; SheetTotal: 17; Size: 11x17; Sheet_Name: ESP32
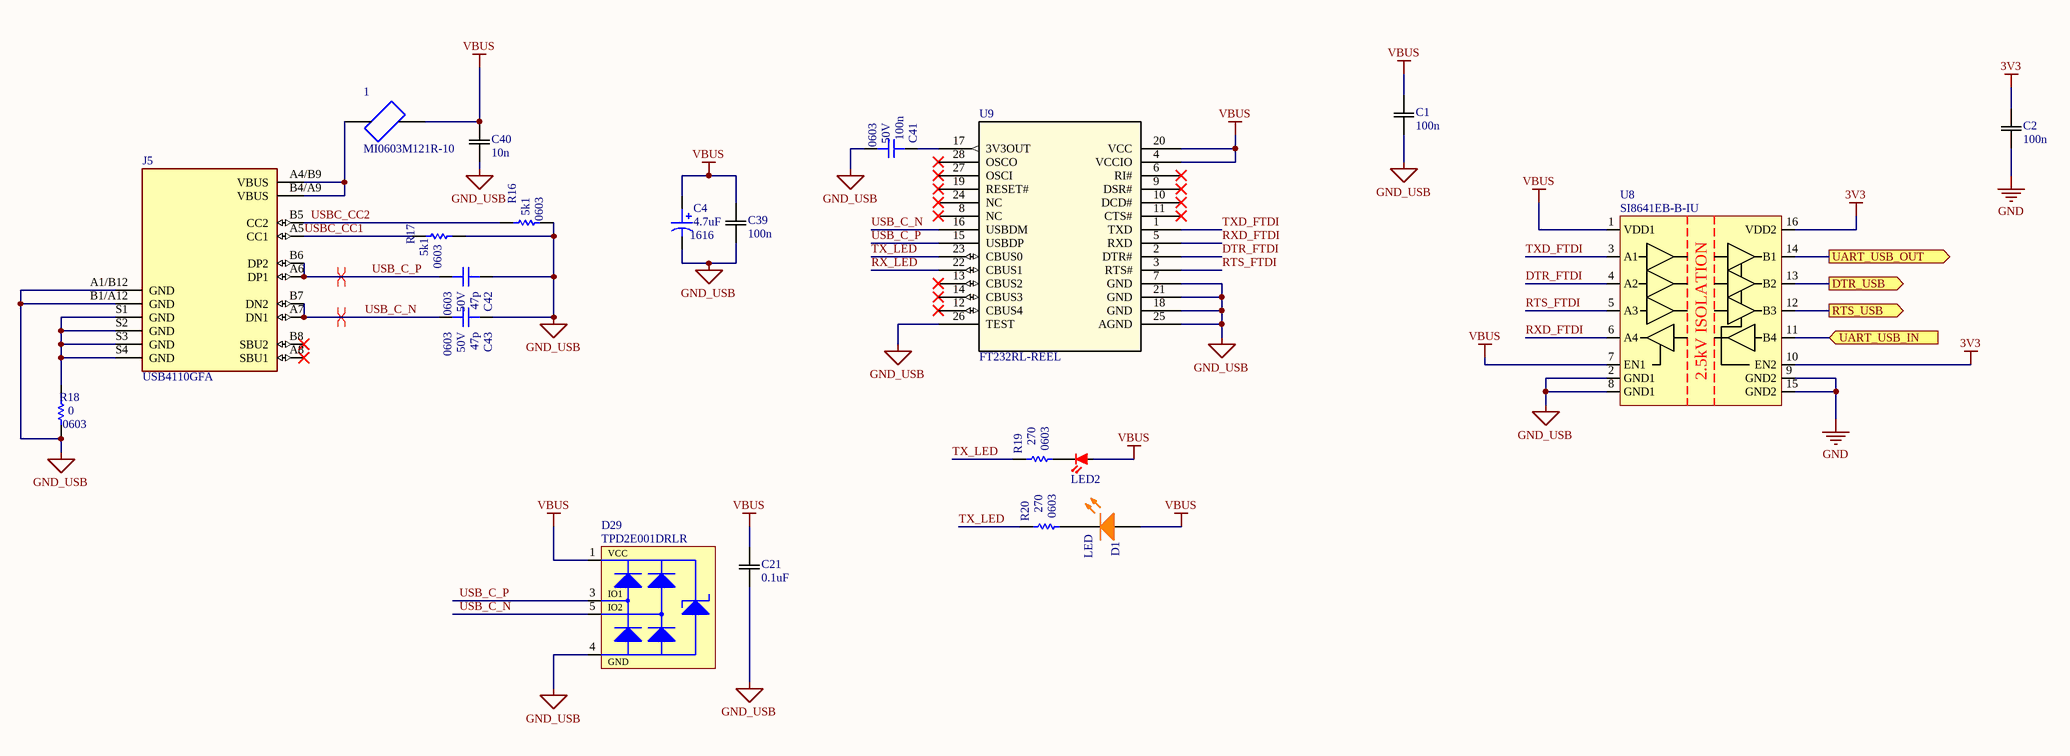
[diagram p5: REGENIX_USB-C.SchDoc]

### Parts
1  MI0603M121R-10  [FB_MI0603M121R-10]
C1  100n  [CAP_CL10_SAM]
C2  100n  [CAP_CL10_SAM]
C4  value 4.7uF  Package: 1616  [CAP_ALU_1616_vishay]  (hidden comment: MAL214699108E3)
C21  0.1uF  [CAP_CL10_SAM]
C39  100n  [CAP_CL10_SAM]
C40  10n  [CAP_CL10_SAM]
C41  value 100n  Voltage: 50V  Package: 0603  [CAP_0603]  (hidden comment: CAP - 0603)
C42  value 47p  Voltage: 50V  Package: 0603  [CAP_0603]  (hidden comment: CAP - 0603)
C43  value 47p  Voltage: 50V  Package: 0603  [CAP_0603]  (hidden comment: CAP - 0603)
D1  LED  [LED_0603]
D29  TPD2E001DRLR  [TVS_USB_TPD2E001DRLR]
J5  USB4110GFA  [GCT_USB4110GFA]
LED2  B1911USD-20D000114U1930  [LED-0603-2PIN]  (value not drawn)
R16  value 5k1  Package: 0603  [RES_0603]  (hidden comment: RES - 0603)
R17  value 5k1  Package: 0603  [RES_0603]  (hidden comment: RES - 0603)
R18  value 0  Package: 0603  [RES_0603]  (hidden comment: RES - 0603)
R19  value 270  Package: 0603  [RES_0603]  (hidden comment: RES - 0603)
R20  value 270  Package: 0603  [RES_0603]  (hidden comment: RES - 0603)
U8  SI8641EB-B-IU  [ISO_SI8641EB-B-IU]
U9  FT232RL-REEL  [IC28_SSOP-28_FTD]

### Ports
DTR_USB (out), RTS_USB (out), UART_USB_IN (in), UART_USB_OUT (out)

### Nets
3V3: C2.2 U8.10(EN2) U8.16(VDD2)
GND: C2.1 U8.9(GND2) U8.15(GND2)
GND_USB: C1.1 C4.2 C21.1 C39.1 C40.1 C41.1 C42.2 C43.2 D29.4(GND) J5.A1/B12(GND) J5.B1/A12(GND) R16.1 R17.1 R18.1 U8.2(GND1) U8.8(GND1) U9.7(GND) U9.18(GND) U9.21(GND) U9.25(AGND) U9.26(TEST)
VBUS: 1.2 C1.2 C4.1 C21.2 C39.2 C40.2 D1.A D29.1(VCC) LED2.2(R) U8.1(VDD1) U8.7(EN1) U9.4(VCCIO) U9.20(VCC)
DTR_FTDI: U8.4(A2) U9.2(DTR#)
DTR_USB: U8.13(B2) ; port DTR_USB
RTS_FTDI: U8.5(A3) U9.3(RTS#)
RTS_USB: U8.12(B3) ; port RTS_USB
RX_LED: U9.22(CBUS1)
RXD_FTDI: U8.6(A4) U9.5(RXD)
TX_LED: R19.2 R20.2 U9.23(CBUS0)
TXD_FTDI: U8.3(A1) U9.1(TXD)
UART_USB_IN: U8.11(B4) ; port UART_USB_IN
UART_USB_OUT: U8.14(B1) ; port UART_USB_OUT
USB_C_N: C43.1 D29.5(IO2) J5.A7(DN1) J5.B7(DN2) U9.16(USBDM)
USB_C_P: C42.1 D29.3(IO1) J5.A6(DP1) J5.B6(DP2) U9.15(USBDP)
USBC_CC1: J5.A5(CC1) R17.2
USBC_CC2: J5.B5(CC2) R16.2
Net1_1: 1.1 J5.A4/B9(VBUS) J5.B4/A9(VBUS)
NetC41_2: C41.2 U9.17(3V3OUT)
NetD1_K: D1.K R20.1
NetJ5_S1: J5.S1(GND) J5.S2(GND) J5.S3(GND) J5.S4(GND) R18.2
NetLED2_1: LED2.1(K) R19.1

Not connected (* = marked no-connect by the designer): D29 2(NC); J5 A8(SBU1)* B8(SBU2)*; U9 6(RI#)* 8(NC)* 9(DSR#)* 10(DCD#)* 11(CTS#)* 12(CBUS4)* 13(CBUS2)* 14(CBUS3)* 19(RESET#)* 24(NC)* 27(OSCI)* 28(OSCO)*

### Layout directives
differential pair: USB_C_N, USB_C_P

### Notes on the sheet
- Sheet Name
- Project Title
- Global Project
- Revision
- Size
- Date
- Group
- Sheet
- of
- Filename
- Designers
- (in symbol ISO_SI8641EB-B-IU) 2.5kV ISOLATION

### Library data of the parts
1 = MI0603M121R-10: Ferrite Bead (Chip Bead), 1.6 x 0.8 x 0.8mm (0603), 120Ohms impedance at 25 MHz; MF: Laird; Package: 0603 Laird; MP: MI0603M121R-10; Check_prices: https://www.snapeda.com/parts/MI0603M121R-10/Laird/view-part/332874/?ref=eda; Value: *; Price: None; Availability: In Stock; SnapEDA_Link: https://www.snapeda.com/parts/MI0603M121R-10/Laird/view-part/332874/?ref=snap
C1 C2 C21 C39 C40 = CL10B104KB8NNWC: as C?#1 on sheet REGENIX_I2C
C4 = CAP_ALU_MAL214699108E3: as C240 on sheet REGENIX_Battery_Protection; Mfg Part Number: MAL214699108E3; HelpURL: http://www.vishay.com/docs/28403/146cti.pdf; CreatedBy: Jonathan Bouchard; Temperature: -55°C to 125°C; Power: *; Supplier 1: Digikey; Supplier Part Number 1: 4442PHCT-ND
C41-C43 = CAP - 0603: Precision: 10%; Current: *; CreatedBy: Jonathan Bouchard; Power: *
D1 = LED_SML-311DTT86: LED - 611nM ORANGE 2mA - 0603 SML-311DTT86; Voltage: 1.8V; Mfg: ROHM Semiconductor; Power: 44mW; Current: 2mA; HelpURL: http://media.digikey.com/pdf/Data%20Sheets/Rohm%20PDFs/SML-311%20Series.pdf; CreatedBy: Jonathan Bouchard; Temperature: -40°C to 85°C; Package: 0603; Precision: *; Mfg Part Number: SML-311DTT86; Supplier 1: Digikey; Supplier Part Number 1: 511-1303-1-ND
D29 = TVS_USB_TPD2E001DRLR: as D?#1 on sheet REGENIX_I2C; Tolerance: *; Current Rating: *; Power Max: *; HelpURL: http://www.ti.com/lit/ds/symlink/tpd2e001.pdf; CreatedBy/Date: Jonathan Bouchard 2018-07-10; VerifiedBy: Arnaud Samson 16-07-18; Temperature: -40°C ~ 85°C (TA); Package: SOT-553; Manufacturer #2: *; Note: *; Assembly Type: SMD; Part Number #2: *; Part Number #1: TPD2E001DRLR; Polarized: YES; Supplier 1: Digi-Key; Supplier Part Number 1: 296-21883-1-ND
J5 = USB4110GFA: USB-C (USB TYPE-C) USB 2.0 Receptacle Connector 24 (16+8 Dummy) Position Surface Mount, Right Angle; MF: Global Connector Technology; SnapEDA_Link: https://www.snapeda.com/parts/USB4110GFA/Global+Connector+Technology/view-part/?ref=snap; Package: None; Value: *; MP: USB4110GFA; Check_prices: https://www.snapeda.com/parts/USB4110GFA/Global+Connector+Technology/view-part/?ref=eda
LED2 = B1911USD-20D000114U1930: LED RED CLEAR 1608 SMD; Package / Case: 0603 (1608 Metric); Mounted: Yes; Supplier 1: Digi-Key; Supplier Part Number 1: 3147-B1911USD-20D000114U1930CT-ND
U8 = ISO_SI8641EB-B-IU: ISO - Quad-Channel Digital Isolator - 16-SSOP; Manufacturer #1: Silicon Labs; Part Number #1: SI8641BA-B-IUR; Voltage Rating: 2.375-5.5V; GRAMS Lib Spec: 2.8c; Magnetic Material: Unknown; Polarized: Yes; Value: *; Tolerance: *; Current Rating: *; Power Max: *; HelpURL: https://www.silabs.com/documents/public/data-sheets/si864x-datasheet.pdf; CreatedBy/Date: Louis-Daniel Gaulin / 25-02-2020; VerifiedBy: C.Paulin - 9/03/2020; Temperature: -40°C ~ 125°C; Package: 16-SSOP; Manufacturer #2: *; Assembly Type: SMD; Part Number #2: *; Supplier 1: Digi-Key; Supplier Part Number 1: 336-4333-1-ND; Cryo: UNKNOWN
U9 = FT232RL-REEL: No Description Available; Mfr_Name: FTDI, Future Technology Devices International Ltd; RefDes: RefDes; Type: Type
R16-R20 = RES - 0603: Current: *; CreatedBy: Jonathan Bouchard

## Sheet REGENIX_ESP32.SchDoc
size Tabloid; Date: Date; Author: Author 1; DocumentNumber: 3; Revision: 1; SheetNumber: 3; SheetTotal: 17; Size: 11x17; Sheet_Name: ESP32
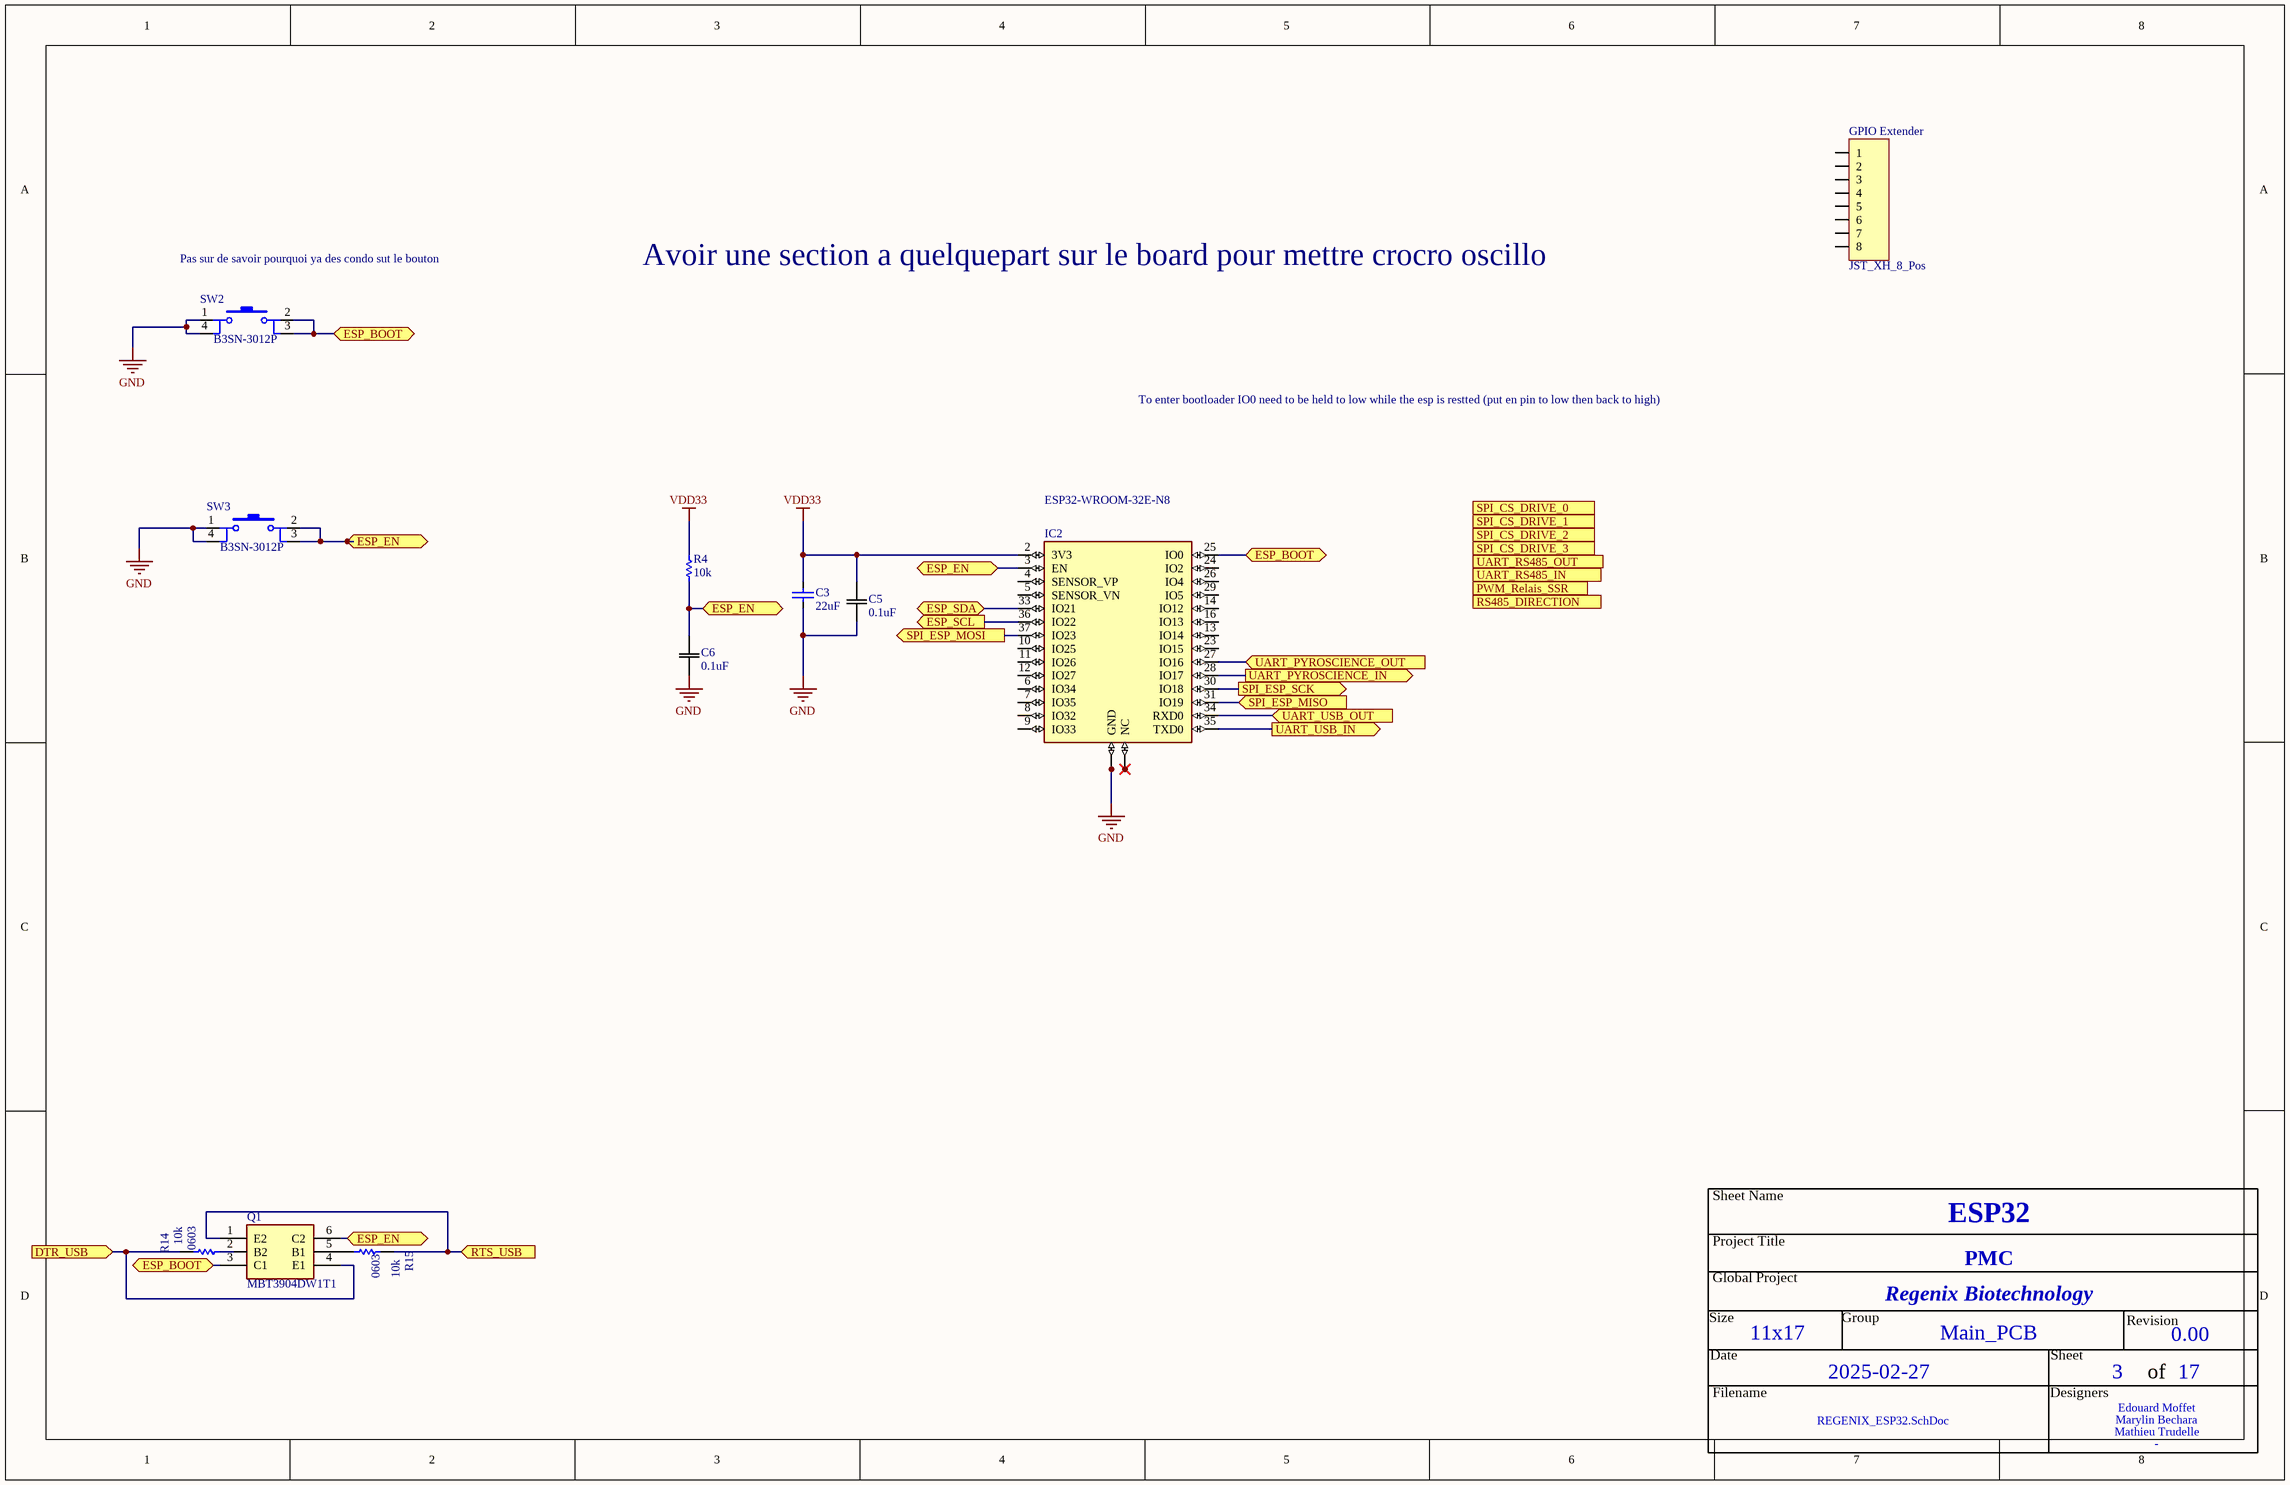
[diagram p6: REGENIX_ESP32.SchDoc]

### Parts
C3  value 22uF  [CAPACITOR-0805]  (hidden comment: Capacitor-0805-22uF-16V-X5R)
C5  0.1uF  [CAP_CL10_SAM]
C6  0.1uF  [CAP_CL10_SAM]
GPIO_Extender  JST_XH_8_Pos  [JST_XH_8_Pos]
IC2  ESP32-WROOM-32E-N8  [ESP32WROOM32EN8]
Q1  MBT3904DW1T1  [SOT65P210X110-6N]
R4  value 10k  [RESISTOR-1206]  (hidden comment: SMT resistor)
R14  value 10k  Package: 0603  [RES_0603]  (hidden comment: RES - 0603)
R15  value 10k  Package: 0603  [RES_0603]  (hidden comment: RES - 0603)
SW2  B3SN-3012P  [SWI_TACT_B3SN-3012P]
SW3  B3SN-3012P  [SWI_TACT_B3SN-3012P]

### Ports
DTR_USB (in), ESP_BOOT (bidir), ESP_EN (bidir), ESP_SCL (out), ESP_SDA (bidir), PWM_Relais_SSR (out), RS485_DIRECTION (out), RTS_USB (in), SPI_CS_DRIVE_0 (out), SPI_CS_DRIVE_1 (out), SPI_CS_DRIVE_2 (out), SPI_CS_DRIVE_3 (out), SPI_ESP_MISO (in), SPI_ESP_MOSI (out), SPI_ESP_SCK (out), UART_PYROSCIENCE_IN (out), UART_PYROSCIENCE_OUT (in), UART_RS485_IN (out), UART_RS485_OUT (in), UART_USB_IN (out), UART_USB_OUT (in)

### Nets
GND: C3.2 C5.1 C6.1 IC2.1(GND) IC2.15(GND) IC2.38(GND) IC2.39(GND) IC2.40(GND) IC2.41(GND) IC2.42(GND) IC2.43(GND) IC2.44(GND) IC2.45(GND) IC2.46(GND) IC2.47(GND) SW2.1 SW2.4 SW3.1 SW3.4
VDD33: C3.1 C5.2 IC2.2(3V3) R4.1
DTR_USB: Q1.4(E1) R14.2 ; port DTR_USB
ESP_BOOT: IC2.25(IO0) Q1.3(C1) SW2.2 SW2.3 ; port ESP_BOOT
ESP_EN: C6.2 IC2.3(EN) Q1.6(C2) R4.2 SW3.2 SW3.3 ; port ESP_EN
ESP_SCL: IC2.36(IO22) ; port ESP_SCL
ESP_SDA: IC2.33(IO21) ; port ESP_SDA
RTS_USB: Q1.1(E2) R15.2 ; port RTS_USB
SPI_ESP_MISO: IC2.31(IO19) ; port SPI_ESP_MISO
SPI_ESP_MOSI: IC2.37(IO23) ; port SPI_ESP_MOSI
SPI_ESP_SCK: IC2.30(IO18) ; port SPI_ESP_SCK
UART_PYROSCIENCE_IN: IC2.28(IO17) ; port UART_PYROSCIENCE_IN
UART_PYROSCIENCE_OUT: IC2.27(IO16) ; port UART_PYROSCIENCE_OUT
UART_USB_IN: IC2.35(TXD0) ; port UART_USB_IN
UART_USB_OUT: IC2.34(RXD0) ; port UART_USB_OUT
NetIC2_17: IC2.17(NC) IC2.18(NC) IC2.19(NC) IC2.20(NC) IC2.21(NC) IC2.22(NC) IC2.32(NC)
NetQ1_2: Q1.2(B2) R14.1
NetQ1_5: Q1.5(B1) R15.1

Not connected (* = marked no-connect by the designer): GPIO_Extender 1 2 3 4 5 6 7 8; IC2 4(SENSOR_VP) 5(SENSOR_VN) 6(IO34) 7(IO35) 8(IO32) 9(IO33) 10(IO25) 11(IO26) 12(IO27) 13(IO14) 14(IO12) 16(IO13) 23(IO15) 24(IO2) 26(IO4) 29(IO5)

### Notes on the sheet
- Pas sur de savoir pourquoi ya des condo sut le bouton
- Avoir une section a quelquepart sur le board pour mettre crocro oscillo
- To enter bootloader IO0 need to be held to low while the esp is restted (put en pin to low then back to high)
- Sheet Name
- Project Title
- Global Project
- Revision
- Size
- Date
- Group
- Sheet
- of
- Filename
- Designers

### Library data of the parts
C3 = Capacitor-0805-22uF-16V-X5R: Precision: X5R-10%; Volt: 16V; Package / Case: Metric 2012 , EIA 0805; Mounted: Yes; Supplier 1: Digi-Key; Supplier Part Number 1: 1276-6780-1-ND; Supplier 2: Digi-Key; Supplier 3: Digi-Key; Supplier 4: Digi-Key
C5 C6 = CL10B104KB8NNWC: as C?#1 on sheet REGENIX_I2C
GPIO_Extender = JST_XH_8_Pos: CONN HEADER VERT 8POS 2.5MM; Supplier 1: Digi-Key; Supplier Part Number 1: 455-B8B-XH-A-ND; Mounted: Yes; Package / Case: TH; Volt: N/A; Help URL: https://www.jst-mfg.com/product/pdf/eng/eXH.pdf
IC2 = ESP32-WROOM-32E-N8: as IC1 on sheet REGENIX_Battery_Protection; SnapEDA_Link: https://www.snapeda.com/parts/ESP32-WROOM-32E-N8/Espressif+Systems/view-part/?ref=snap; Package: SMD-44 Espressif Systems; Value: *; MP: ESP32-WROOM-32E-N8; Check_prices: https://www.snapeda.com/parts/ESP32-WROOM-32E-N8/Espressif+Systems/view-part/?ref=eda
Q1 = MBT3904DW1T1: Transistor; Manufacturer_Name: onsemi; Datasheet Link: https://www.onsemi.com/download/data-sheet/pdf/MBT3904DW1T1-D.PDF; Height: 1.1mm; Manufacturer_Part_Number: MBT3904DW1T1; Mouser Part Number: 863-MBT3904DW1T1; Mouser Price/Stock: https://www.mouser.co.uk/ProductDetail/onsemi/MBT3904DW1T1?qs=3JMERSakebpLNkv8FfUEPQ%3D%3D
R4 = Resistor1206-10k: Precision: 1%; Watt: 0.1W; Mounted: Yes; Package / Case: Metric 3216, EIA 1206; Supplier 2: Digi-Key; Supplier 4: Digi-Key; Supplier 1: Digi-Key; Supplier 3: Digi-Key; Supplier Part Number 1: RMCF1206FT10K0TR-ND
R14 R15 = RES - 0603: Precision: 1%; Current: *; CreatedBy: Jonathan Bouchard
SW2 SW3 = SWI_TACT_B3SN-3012P: SWI - TACT SPST-NO 0.05A 24V - 4-SMD; Current: 50mA; Mfg: Omron; Mfg Part Number: B3SN-3012P; HelpURL: http://www.omron.com/ecb/products/pdf/en-b3sn.pdf; CreatedBy: Jonathan Bouchard; Temperature: -25°C ~ 70°C; Power: *; Precision: *; Package: 4-SMD; Value: *; Voltage: 24V; Supplier 1: Digikey; Supplier Part Number 1: SW261CT-ND

## Sheet REGENIX_DRIVER.SchDoc
size A4; SheetNumber: 11; SheetTotal: 12
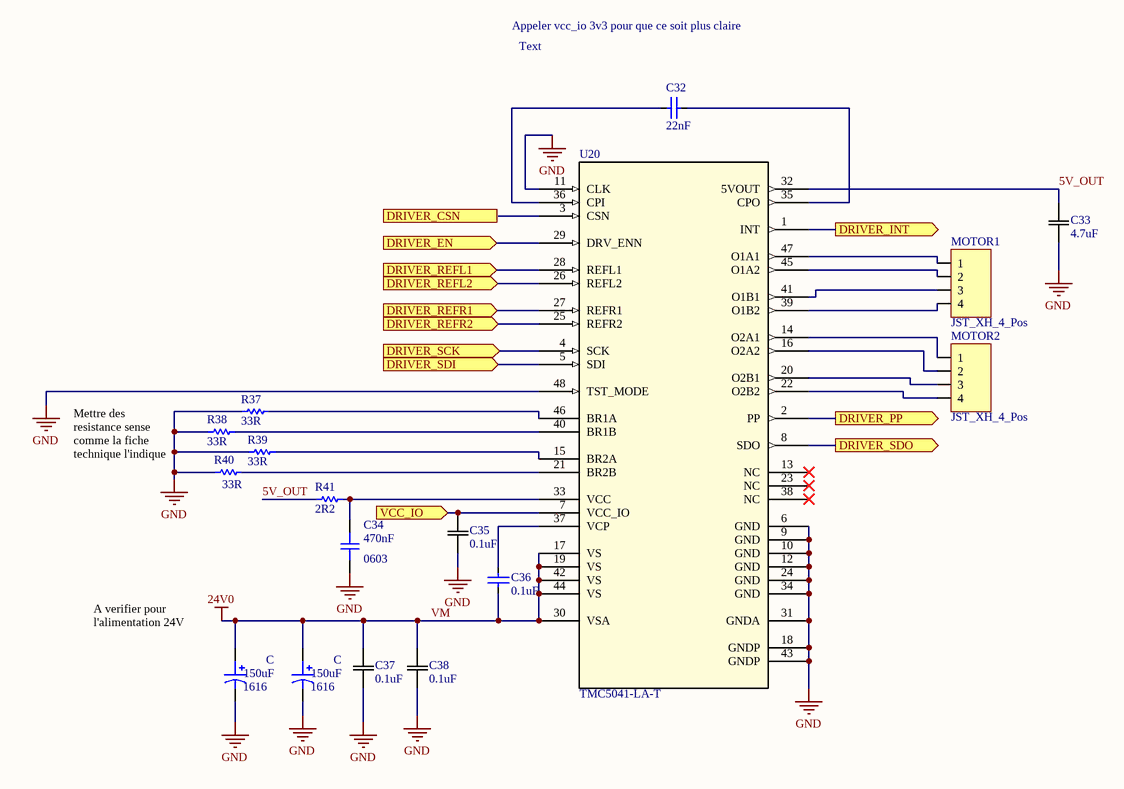
[diagram p7: REGENIX_DRIVER.SchDoc]

### Parts
(Parts that share a designator on the sheet are numbered #1, #2 ... from top to bottom, then left to right.)
C32  value 22nF  [CAPACITOR-0603]  (hidden comment: Capacitor-0603-0.22uF-25V-X7R)
C33  4.7uF  [CAP_CL21_SAM]
C34  value 470nF  Package: 0603  [CAP_0603]  (hidden comment: CAP - 0603)
C35  0.1uF  [CAP_CL10_SAM]
C36  value 0.1uF  [CAPACITOR-0603]  (hidden comment: Capacitor-0603-0.22uF-25V-X7R)
C37  0.1uF  [CAP_CL10_SAM]
C38  0.1uF  [CAP_CL10_SAM]
C#1  value 150uF  Package: 1616  [CAP_ALU_1616_vishay]  (hidden comment: MAL214699108E3)
C#2  value 150uF  Package: 1616  [CAP_ALU_1616_vishay]  (hidden comment: MAL214699108E3)
MOTOR1  JST_XH_4_Pos  [JST_XH_4_Pos]
MOTOR2  JST_XH_4_Pos  [JST_XH_4_Pos]
R37  value 33R  [RESISTOR-1206]  (hidden comment: SMT resistor)
R38  value 33R  [RESISTOR-1206]  (hidden comment: SMT resistor)
R39  value 33R  [RESISTOR-1206]  (hidden comment: SMT resistor)
R40  value 33R  [RESISTOR-1206]  (hidden comment: SMT resistor)
R41  value 2R2  [Resistor-0603]  (hidden comment: SMT resistor)
U20  TMC5041-LA-T  [QFN48_7X7_TRI]

### Ports
DRIVER_CSN (in), DRIVER_EN (in), DRIVER_INT (out), DRIVER_PP (out), DRIVER_REFL1 (in), DRIVER_REFL2 (in), DRIVER_REFR1 (in), DRIVER_REFR2 (in), DRIVER_SCK (in), DRIVER_SDI (in), DRIVER_SDO (out), VCC_IO (in)

### Nets
GND: C33.1 C34.1 C35.1 C37.1 C38.1 C#1.2 C#2.2 R37.1 R38.1 R39.1 R40.1 U20.6(GND) U20.9(GND) U20.10(GND) U20.11(CLK) U20.12(GND) U20.18(GNDP) U20.24(GND) U20.31(GNDA) U20.34(GND) U20.43(GNDP) U20.48(TST_MODE)
VM: C36.1 C37.2 C38.2 C#1.1 C#2.1 U20.17(VS) U20.19(VS) U20.30(VSA) U20.42(VS) U20.44(VS)  [also labelled 24V0]
5V_OUT: C33.2 R41.1 U20.32(5VOUT)
DRIVER_EN: U20.29(DRV_ENN) ; port DRIVER_EN
DRIVER_INT: U20.1(INT) ; port DRIVER_INT
DRIVER_PP: U20.2(PP) ; port DRIVER_PP
DRIVER_REFL1: U20.28(REFL1) ; port DRIVER_REFL1
DRIVER_REFL2: U20.26(REFL2) ; port DRIVER_REFL2
DRIVER_REFR1: U20.27(REFR1) ; port DRIVER_REFR1
DRIVER_REFR2: U20.25(REFR2) ; port DRIVER_REFR2
DRIVER_SCK: U20.4(SCK) ; port DRIVER_SCK
DRIVER_SDI: U20.5(SDI) ; port DRIVER_SDI
DRIVER_SDO: U20.8(SDO) ; port DRIVER_SDO
VCC_IO: C35.2 U20.7(VCC_IO) ; port VCC_IO
NetC32_1: C32.1 U20.36(CPI)
NetC32_2: C32.2 U20.35(CPO)
NetC34_2: C34.2 R41.2 U20.33(VCC)
NetC36_2: C36.2 U20.37(VCP)
NetMOTOR1_1: MOTOR1.1 U20.47(O1A1)
NetMOTOR1_2: MOTOR1.2 U20.45(O1A2)
NetMOTOR1_3: MOTOR1.3 U20.41(O1B1)
NetMOTOR1_4: MOTOR1.4 U20.39(O1B2)
NetMOTOR2_1: MOTOR2.1 U20.14(O2A1)
NetMOTOR2_2: MOTOR2.2 U20.16(O2A2)
NetMOTOR2_3: MOTOR2.3 U20.20(O2B1)
NetMOTOR2_4: MOTOR2.4 U20.22(O2B2)
NetR37_2: R37.2 U20.46(BR1A)
NetR38_2: R38.2 U20.40(BR1B)
NetR39_2: R39.2 U20.15(BR2A)
NetR40_2: R40.2 U20.21(BR2B)

Not connected (* = marked no-connect by the designer): U20 3(CSN) 13(NC)* 23(NC)* 38(NC)*

### Notes on the sheet
- Appeler vcc_io 3v3 pour que ce soit plus claire
- Text
- Mettre des resistance sense comme la fiche technique l'indique
- (near C#1) A verifier pour l'alimentation 24V

### Library data of the parts
C32 C36 = Capacitor-0603-0.22uF-25V-X7R: Precision: X7R-10%; Volt: 25V; Package / Case: Metric 1608, EIA 0603; Mounted: Yes; Supplier 1: Digi-Key; Supplier Part Number 1: 490-4935-2-ND; Supplier 2: Digi-Key; Supplier 3: Digi-Key; Supplier 4: Digi-Key
C33 = CL21A475KAQNNNE: CAP CER 4.7UF 25V X5R 0805  CL21A475KAQNNNE; Mfr_Name: Samsung
C34 = CAP - 0603: Precision: 10%; Current: *; CreatedBy: Jonathan Bouchard; Power: *
C35 C37 C38 = CL10B104KB8NNWC: as C?#1 on sheet REGENIX_I2C
C#1 C#2 = CAP_ALU_MAL214699108E3: as C240 on sheet REGENIX_Battery_Protection; Mfg Part Number: MAL214699108E3; HelpURL: http://www.vishay.com/docs/28403/146cti.pdf; CreatedBy: Jonathan Bouchard; Temperature: -55°C to 125°C; Power: *; Supplier 1: Digikey; Supplier Part Number 1: 4442PHCT-ND
MOTOR1 MOTOR2 = JST_XH_4_Pos: CONN HEADER VERT 4POS 2.5MM; Supplier 1: Digi-Key; Supplier Part Number 1: 455-2237-ND; Mounted: Yes; Package / Case: TH; Volt: N/A
R37-R40 = Resistor1206-33R: Precision: 1%; Watt: 0.1W; Mounted: Yes; Package / Case: Metric 3216, EIA 1206; Supplier 2: Digi-Key; Supplier 4: Digi-Key; Supplier 1: Digi-Key; Supplier 3: Digi-Key; Supplier Part Number 1: 311-33.0FRTR-ND
R41 = Resistor0603-22R: Precision: 1%; Watt: 0.1W; Mounted: Yes; Package / Case: Metric 1608, EIA 0603; Supplier 2: Digi-Key; Supplier 4: Digi-Key; Supplier 1: Digi-Key; Supplier 3: Digi-Key; Supplier Part Number 1: RMCF0603FT22R0CT-ND
U20 = TMC5041-LA-T: No Description Available; Mfr_Name: Analog Devices / Trinamic; RefDes: RefDes; Type: Type

## Sheet REGENIX_Convertisseurs.SchDoc
size A4; SheetNumber: 10; SheetTotal: 12
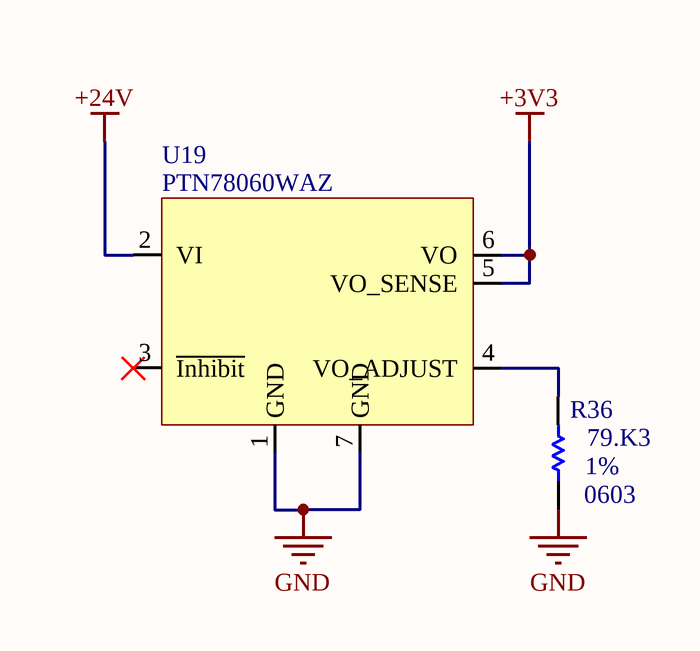
[diagram p8: REGENIX_Convertisseurs.SchDoc]

### Parts
R36  value 79.K3  Package: 0603  Precision: 1%  [RES_0603]  (hidden comment: RES - 0603)
U19  PTN78060WAZ  [REG_SWR_PTN78060WAZ]

### Nets
+3V3: U19.5(VO_SENSE) U19.6(VO)
+24V: U19.2(VI)
GND: R36.1 U19.1(GND) U19.7(GND)
NetR36_2: R36.2 U19.4(VO_ADJUST)

Not connected (* = marked no-connect by the designer): U19 3(~{Inhibit})*

### Library data of the parts
U19 = REG_SWR_PTN78060WAZ: REG - DC-DC Module 2.5V~12.6V ADJ OUT 3A  - 7-SMD; Manufacturer #1: Texas Instruments; Value: 2.5~12.6V (OUT); Tolerance: 3%; Voltage Rating: 7~36V (IN); GRAMS Lib Spec: 2.8; Magnetic Material: Unknown; Polarized: Yes; Current Rating: 3A; Power Max: -; HelpURL: http://www.ti.com/lit/ds/symlink/ptn78060w.pdf; CreatedBy/Date: Danae D-F 28 juin 2019; VerifiedBy: Nicolas V. (2019-07-15); Temperature: -40°C ~ 85°C; Package: 7-SMD; Manufacturer #2: -; Assembly Type: SMD; Part Number #2: -; Part Number #1: PTN78060WAZ; Supplier 1: Digi-Key; Supplier Part Number 1: 296-20525-ND; Cryo: UNKNOWN
R36 = RES - 0603: Current: *; CreatedBy: Jonathan Bouchard

## Sheet REGENIX_DRIVER_2.SchDoc
size A4; SheetNumber: 12; SheetTotal: 17
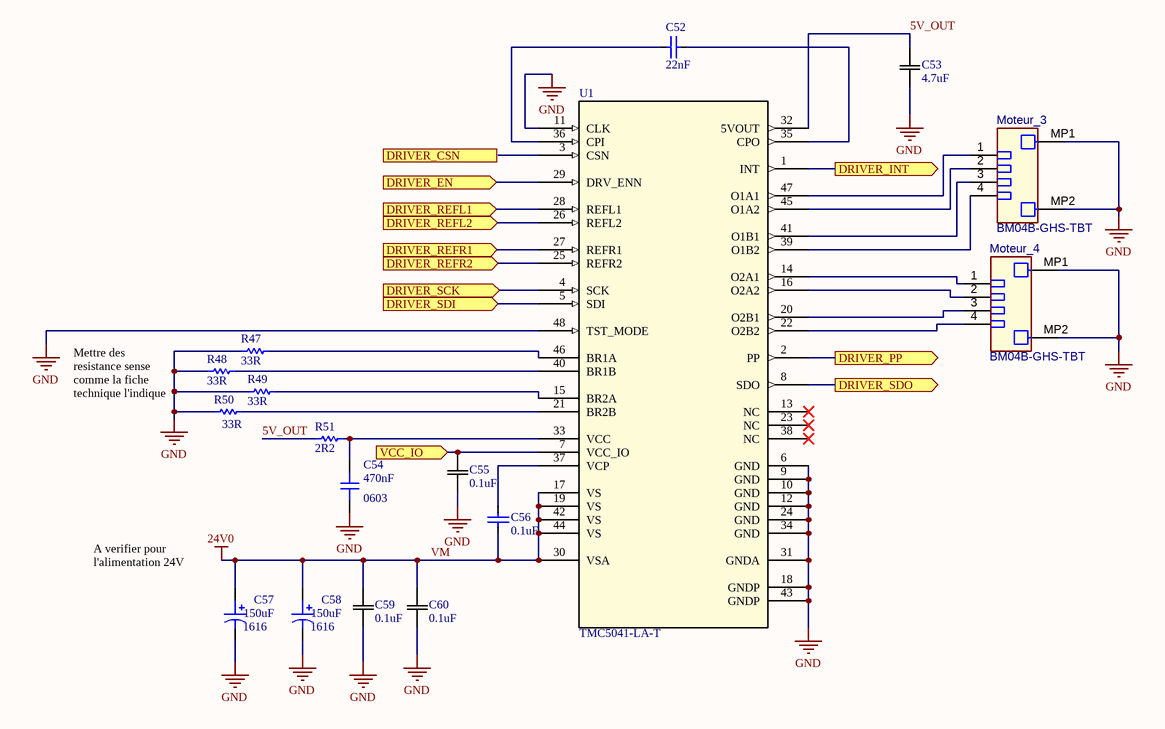
[diagram p9: REGENIX_DRIVER_2.SchDoc]

### Parts
C52  value 22nF  [CAPACITOR-0603]  (hidden comment: Capacitor-0603-0.22uF-25V-X7R)
C53  4.7uF  [CAP_CL21_SAM]
C54  value 470nF  Package: 0603  [CAP_0603]  (hidden comment: CAP - 0603)
C55  0.1uF  [CAP_CL10_SAM]
C56  value 0.1uF  [CAPACITOR-0603]  (hidden comment: Capacitor-0603-0.22uF-25V-X7R)
C57  value 150uF  Package: 1616  [CAP_ALU_1616_vishay]  (hidden comment: MAL214699108E3)
C58  value 150uF  Package: 1616  [CAP_ALU_1616_vishay]  (hidden comment: MAL214699108E3)
C59  0.1uF  [CAP_CL10_SAM]
C60  0.1uF  [CAP_CL10_SAM]
Moteur_3  BM04B-GHS-TBT  [JST-BM04B-GHS-TBT_V]
Moteur_4  BM04B-GHS-TBT  [JST-BM04B-GHS-TBT_V]
R47  value 33R  [RESISTOR-1206]  (hidden comment: SMT resistor)
R48  value 33R  [RESISTOR-1206]  (hidden comment: SMT resistor)
R49  value 33R  [RESISTOR-1206]  (hidden comment: SMT resistor)
R50  value 33R  [RESISTOR-1206]  (hidden comment: SMT resistor)
R51  value 2R2  [Resistor-0603]  (hidden comment: SMT resistor)
U1  TMC5041-LA-T  [QFN48_7X7_TRI]

### Ports
DRIVER_CSN (in), DRIVER_EN (in), DRIVER_INT (out), DRIVER_PP (out), DRIVER_REFL1 (in), DRIVER_REFL2 (in), DRIVER_REFR1 (in), DRIVER_REFR2 (in), DRIVER_SCK (in), DRIVER_SDI (in), DRIVER_SDO (out), VCC_IO (in)

### Nets
GND: C53.1 C54.1 C55.1 C57.2 C58.2 C59.1 C60.1 Moteur_3.MP1 Moteur_3.MP2 Moteur_4.MP1 Moteur_4.MP2 R47.1 R48.1 R49.1 R50.1 U1.6(GND) U1.9(GND) U1.10(GND) U1.11(CLK) U1.12(GND) U1.18(GNDP) U1.24(GND) U1.31(GNDA) U1.34(GND) U1.43(GNDP) U1.48(TST_MODE)
VM: C56.1 C57.1 C58.1 C59.2 C60.2 U1.17(VS) U1.19(VS) U1.30(VSA) U1.42(VS) U1.44(VS)  [also labelled 24V0]
5V_OUT: C53.2 R51.1 U1.32(5VOUT)
DRIVER_EN: U1.29(DRV_ENN) ; port DRIVER_EN
DRIVER_INT: U1.1(INT) ; port DRIVER_INT
DRIVER_PP: U1.2(PP) ; port DRIVER_PP
DRIVER_REFL1: U1.28(REFL1) ; port DRIVER_REFL1
DRIVER_REFL2: U1.26(REFL2) ; port DRIVER_REFL2
DRIVER_REFR1: U1.27(REFR1) ; port DRIVER_REFR1
DRIVER_REFR2: U1.25(REFR2) ; port DRIVER_REFR2
DRIVER_SCK: U1.4(SCK) ; port DRIVER_SCK
DRIVER_SDI: U1.5(SDI) ; port DRIVER_SDI
DRIVER_SDO: U1.8(SDO) ; port DRIVER_SDO
VCC_IO: C55.2 U1.7(VCC_IO) ; port VCC_IO
NetC52_1: C52.1 U1.36(CPI)
NetC52_2: C52.2 U1.35(CPO)
NetC54_2: C54.2 R51.2 U1.33(VCC)
NetC56_2: C56.2 U1.37(VCP)
NetMoteur_3_1: Moteur_3.1 U1.47(O1A1)
NetMoteur_3_2: Moteur_3.2 U1.45(O1A2)
NetMoteur_3_3: Moteur_3.3 U1.41(O1B1)
NetMoteur_3_4: Moteur_3.4 U1.39(O1B2)
NetMoteur_4_1: Moteur_4.1 U1.14(O2A1)
NetMoteur_4_2: Moteur_4.2 U1.16(O2A2)
NetMoteur_4_3: Moteur_4.3 U1.20(O2B1)
NetMoteur_4_4: Moteur_4.4 U1.22(O2B2)
NetR47_2: R47.2 U1.46(BR1A)
NetR48_2: R48.2 U1.40(BR1B)
NetR49_2: R49.2 U1.15(BR2A)
NetR50_2: R50.2 U1.21(BR2B)

Not connected (* = marked no-connect by the designer): U1 3(CSN) 13(NC)* 23(NC)* 38(NC)*

### Notes on the sheet
- Mettre des resistance sense comme la fiche technique l'indique
- (near C57) A verifier pour l'alimentation 24V

### Library data of the parts
C52 C56 = Capacitor-0603-0.22uF-25V-X7R: Precision: X7R-10%; Volt: 25V; Package / Case: Metric 1608, EIA 0603; Mounted: Yes; Supplier 1: Digi-Key; Supplier Part Number 1: 490-4935-2-ND; Supplier 2: Digi-Key; Supplier 3: Digi-Key; Supplier 4: Digi-Key
C53 = CL21A475KAQNNNE: as C33 on sheet REGENIX_DRIVER
C54 = CAP - 0603: Precision: 10%; Current: *; CreatedBy: Jonathan Bouchard; Power: *
C55 C59 C60 = CL10B104KB8NNWC: as C?#1 on sheet REGENIX_I2C
C57 C58 = CAP_ALU_MAL214699108E3: as C240 on sheet REGENIX_Battery_Protection; Mfg Part Number: MAL214699108E3; HelpURL: http://www.vishay.com/docs/28403/146cti.pdf; CreatedBy: Jonathan Bouchard; Temperature: -55°C to 125°C; Power: *; Supplier 1: Digikey; Supplier Part Number 1: 4442PHCT-ND
Moteur_3 Moteur_4 = CMP-002-00053-3: Header, Pitch 1.25 mm, 1 x 4 Position, Height 4.05 mm, -25 to 85 degC; Pins: 6
R47-R50 = Resistor1206-33R: Precision: 1%; Watt: 0.1W; Mounted: Yes; Package / Case: Metric 3216, EIA 1206; Supplier 2: Digi-Key; Supplier 4: Digi-Key; Supplier 1: Digi-Key; Supplier 3: Digi-Key; Supplier Part Number 1: 311-33.0FRTR-ND
R51 = Resistor0603-22R: Precision: 1%; Watt: 0.1W; Mounted: Yes; Package / Case: Metric 1608, EIA 0603; Supplier 2: Digi-Key; Supplier 4: Digi-Key; Supplier 1: Digi-Key; Supplier 3: Digi-Key; Supplier Part Number 1: RMCF0603FT22R0CT-ND
U1 = TMC5041-LA-T: as U20 on sheet REGENIX_DRIVER; RefDes: RefDes; Type: Type

## Sheet REGENIX_DRIVER_3.SchDoc
size A4; SheetNumber: 13; SheetTotal: 17
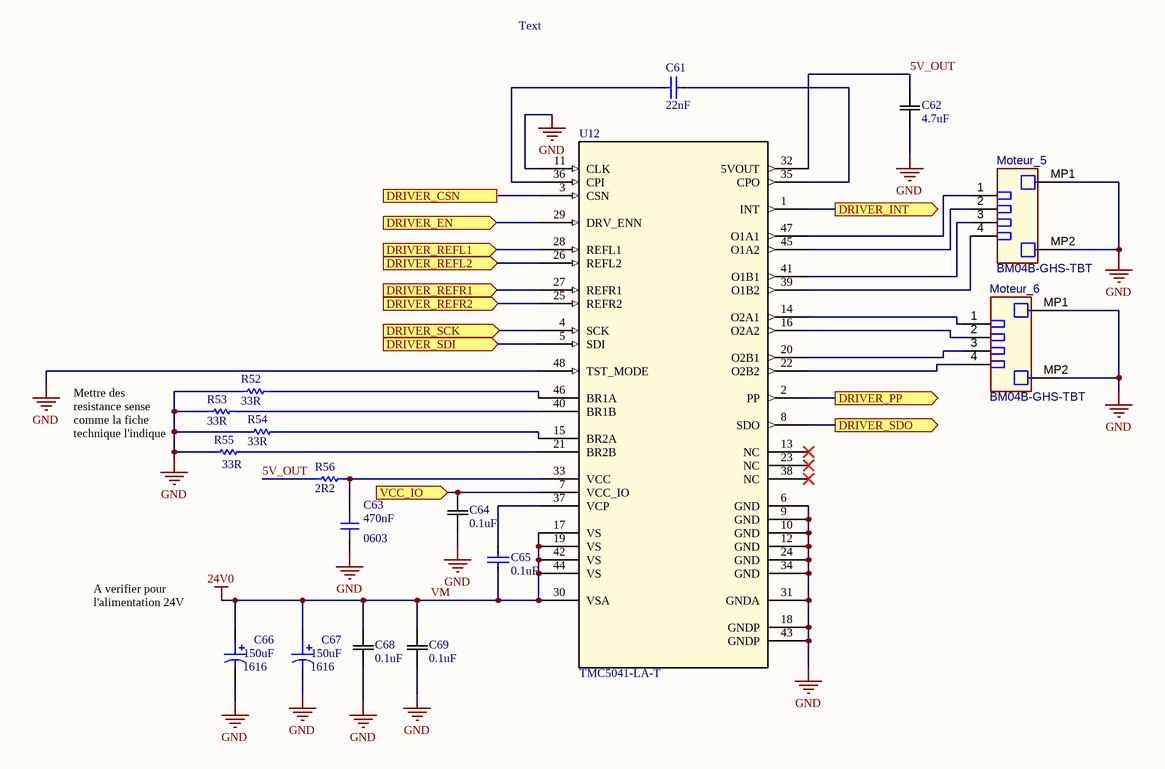
[diagram p10: REGENIX_DRIVER_3.SchDoc]

### Parts
C61  value 22nF  [CAPACITOR-0603]  (hidden comment: Capacitor-0603-0.22uF-25V-X7R)
C62  4.7uF  [CAP_CL21_SAM]
C63  value 470nF  Package: 0603  [CAP_0603]  (hidden comment: CAP - 0603)
C64  0.1uF  [CAP_CL10_SAM]
C65  value 0.1uF  [CAPACITOR-0603]  (hidden comment: Capacitor-0603-0.22uF-25V-X7R)
C66  value 150uF  Package: 1616  [CAP_ALU_1616_vishay]  (hidden comment: MAL214699108E3)
C67  value 150uF  Package: 1616  [CAP_ALU_1616_vishay]  (hidden comment: MAL214699108E3)
C68  0.1uF  [CAP_CL10_SAM]
C69  0.1uF  [CAP_CL10_SAM]
Moteur_5  BM04B-GHS-TBT  [JST-BM04B-GHS-TBT_V]
Moteur_6  BM04B-GHS-TBT  [JST-BM04B-GHS-TBT_V]
R52  value 33R  [RESISTOR-1206]  (hidden comment: SMT resistor)
R53  value 33R  [RESISTOR-1206]  (hidden comment: SMT resistor)
R54  value 33R  [RESISTOR-1206]  (hidden comment: SMT resistor)
R55  value 33R  [RESISTOR-1206]  (hidden comment: SMT resistor)
R56  value 2R2  [Resistor-0603]  (hidden comment: SMT resistor)
U12  TMC5041-LA-T  [QFN48_7X7_TRI]

### Ports
DRIVER_CSN (in), DRIVER_EN (in), DRIVER_INT (out), DRIVER_PP (out), DRIVER_REFL1 (in), DRIVER_REFL2 (in), DRIVER_REFR1 (in), DRIVER_REFR2 (in), DRIVER_SCK (in), DRIVER_SDI (in), DRIVER_SDO (out), VCC_IO (in)

### Nets
GND: C62.1 C63.1 C64.1 C66.2 C67.2 C68.1 C69.1 Moteur_5.MP1 Moteur_5.MP2 Moteur_6.MP1 Moteur_6.MP2 R52.1 R53.1 R54.1 R55.1 U12.6(GND) U12.9(GND) U12.10(GND) U12.11(CLK) U12.12(GND) U12.18(GNDP) U12.24(GND) U12.31(GNDA) U12.34(GND) U12.43(GNDP) U12.48(TST_MODE)
VM: C65.1 C66.1 C67.1 C68.2 C69.2 U12.17(VS) U12.19(VS) U12.30(VSA) U12.42(VS) U12.44(VS)  [also labelled 24V0]
5V_OUT: C62.2 R56.1 U12.32(5VOUT)
DRIVER_EN: U12.29(DRV_ENN) ; port DRIVER_EN
DRIVER_INT: U12.1(INT) ; port DRIVER_INT
DRIVER_PP: U12.2(PP) ; port DRIVER_PP
DRIVER_REFL1: U12.28(REFL1) ; port DRIVER_REFL1
DRIVER_REFL2: U12.26(REFL2) ; port DRIVER_REFL2
DRIVER_REFR1: U12.27(REFR1) ; port DRIVER_REFR1
DRIVER_REFR2: U12.25(REFR2) ; port DRIVER_REFR2
DRIVER_SCK: U12.4(SCK) ; port DRIVER_SCK
DRIVER_SDI: U12.5(SDI) ; port DRIVER_SDI
DRIVER_SDO: U12.8(SDO) ; port DRIVER_SDO
VCC_IO: C64.2 U12.7(VCC_IO) ; port VCC_IO
NetC61_1: C61.1 U12.36(CPI)
NetC61_2: C61.2 U12.35(CPO)
NetC63_2: C63.2 R56.2 U12.33(VCC)
NetC65_2: C65.2 U12.37(VCP)
NetMoteur_5_1: Moteur_5.1 U12.47(O1A1)
NetMoteur_5_2: Moteur_5.2 U12.45(O1A2)
NetMoteur_5_3: Moteur_5.3 U12.41(O1B1)
NetMoteur_5_4: Moteur_5.4 U12.39(O1B2)
NetMoteur_6_1: Moteur_6.1 U12.14(O2A1)
NetMoteur_6_2: Moteur_6.2 U12.16(O2A2)
NetMoteur_6_3: Moteur_6.3 U12.20(O2B1)
NetMoteur_6_4: Moteur_6.4 U12.22(O2B2)
NetR52_2: R52.2 U12.46(BR1A)
NetR53_2: R53.2 U12.40(BR1B)
NetR54_2: R54.2 U12.15(BR2A)
NetR55_2: R55.2 U12.21(BR2B)

Not connected (* = marked no-connect by the designer): U12 3(CSN) 13(NC)* 23(NC)* 38(NC)*

### Notes on the sheet
- Text
- Mettre des resistance sense comme la fiche technique l'indique
- (near C66) A verifier pour l'alimentation 24V

### Library data of the parts
C61 C65 = Capacitor-0603-0.22uF-25V-X7R: Precision: X7R-10%; Volt: 25V; Package / Case: Metric 1608, EIA 0603; Mounted: Yes; Supplier 1: Digi-Key; Supplier Part Number 1: 490-4935-2-ND; Supplier 2: Digi-Key; Supplier 3: Digi-Key; Supplier 4: Digi-Key
C62 = CL21A475KAQNNNE: as C33 on sheet REGENIX_DRIVER
C63 = CAP - 0603: Precision: 10%; Current: *; CreatedBy: Jonathan Bouchard; Power: *
C64 C68 C69 = CL10B104KB8NNWC: as C?#1 on sheet REGENIX_I2C
C66 C67 = CAP_ALU_MAL214699108E3: as C240 on sheet REGENIX_Battery_Protection; Mfg Part Number: MAL214699108E3; HelpURL: http://www.vishay.com/docs/28403/146cti.pdf; CreatedBy: Jonathan Bouchard; Temperature: -55°C to 125°C; Power: *; Supplier 1: Digikey; Supplier Part Number 1: 4442PHCT-ND
Moteur_5 Moteur_6 = CMP-002-00053-3: as Moteur_3 on sheet REGENIX_DRIVER_2; Pins: 6
R52-R55 = Resistor1206-33R: Precision: 1%; Watt: 0.1W; Mounted: Yes; Package / Case: Metric 3216, EIA 1206; Supplier 2: Digi-Key; Supplier 4: Digi-Key; Supplier 1: Digi-Key; Supplier 3: Digi-Key; Supplier Part Number 1: 311-33.0FRTR-ND
R56 = Resistor0603-22R: Precision: 1%; Watt: 0.1W; Mounted: Yes; Package / Case: Metric 1608, EIA 0603; Supplier 2: Digi-Key; Supplier 4: Digi-Key; Supplier 1: Digi-Key; Supplier 3: Digi-Key; Supplier Part Number 1: RMCF0603FT22R0CT-ND
U12 = TMC5041-LA-T: as U20 on sheet REGENIX_DRIVER; RefDes: RefDes; Type: Type